# EasyEDA Pro project UltraSonic_Anemometer_HW.eprj

# Schematic Schematic1

## Sheets
1 TOP_LEVEL: Board Name: Board1; Create Date: 2025-11-26; Page Name: TOP_LEVEL; Project Name: UltraSonic_Anemometer_HW; Schematic Name: Schematic1; Update Date: 2025-11-26; Company: Tom Armstrong; Page Size: A4; Version: V1.0
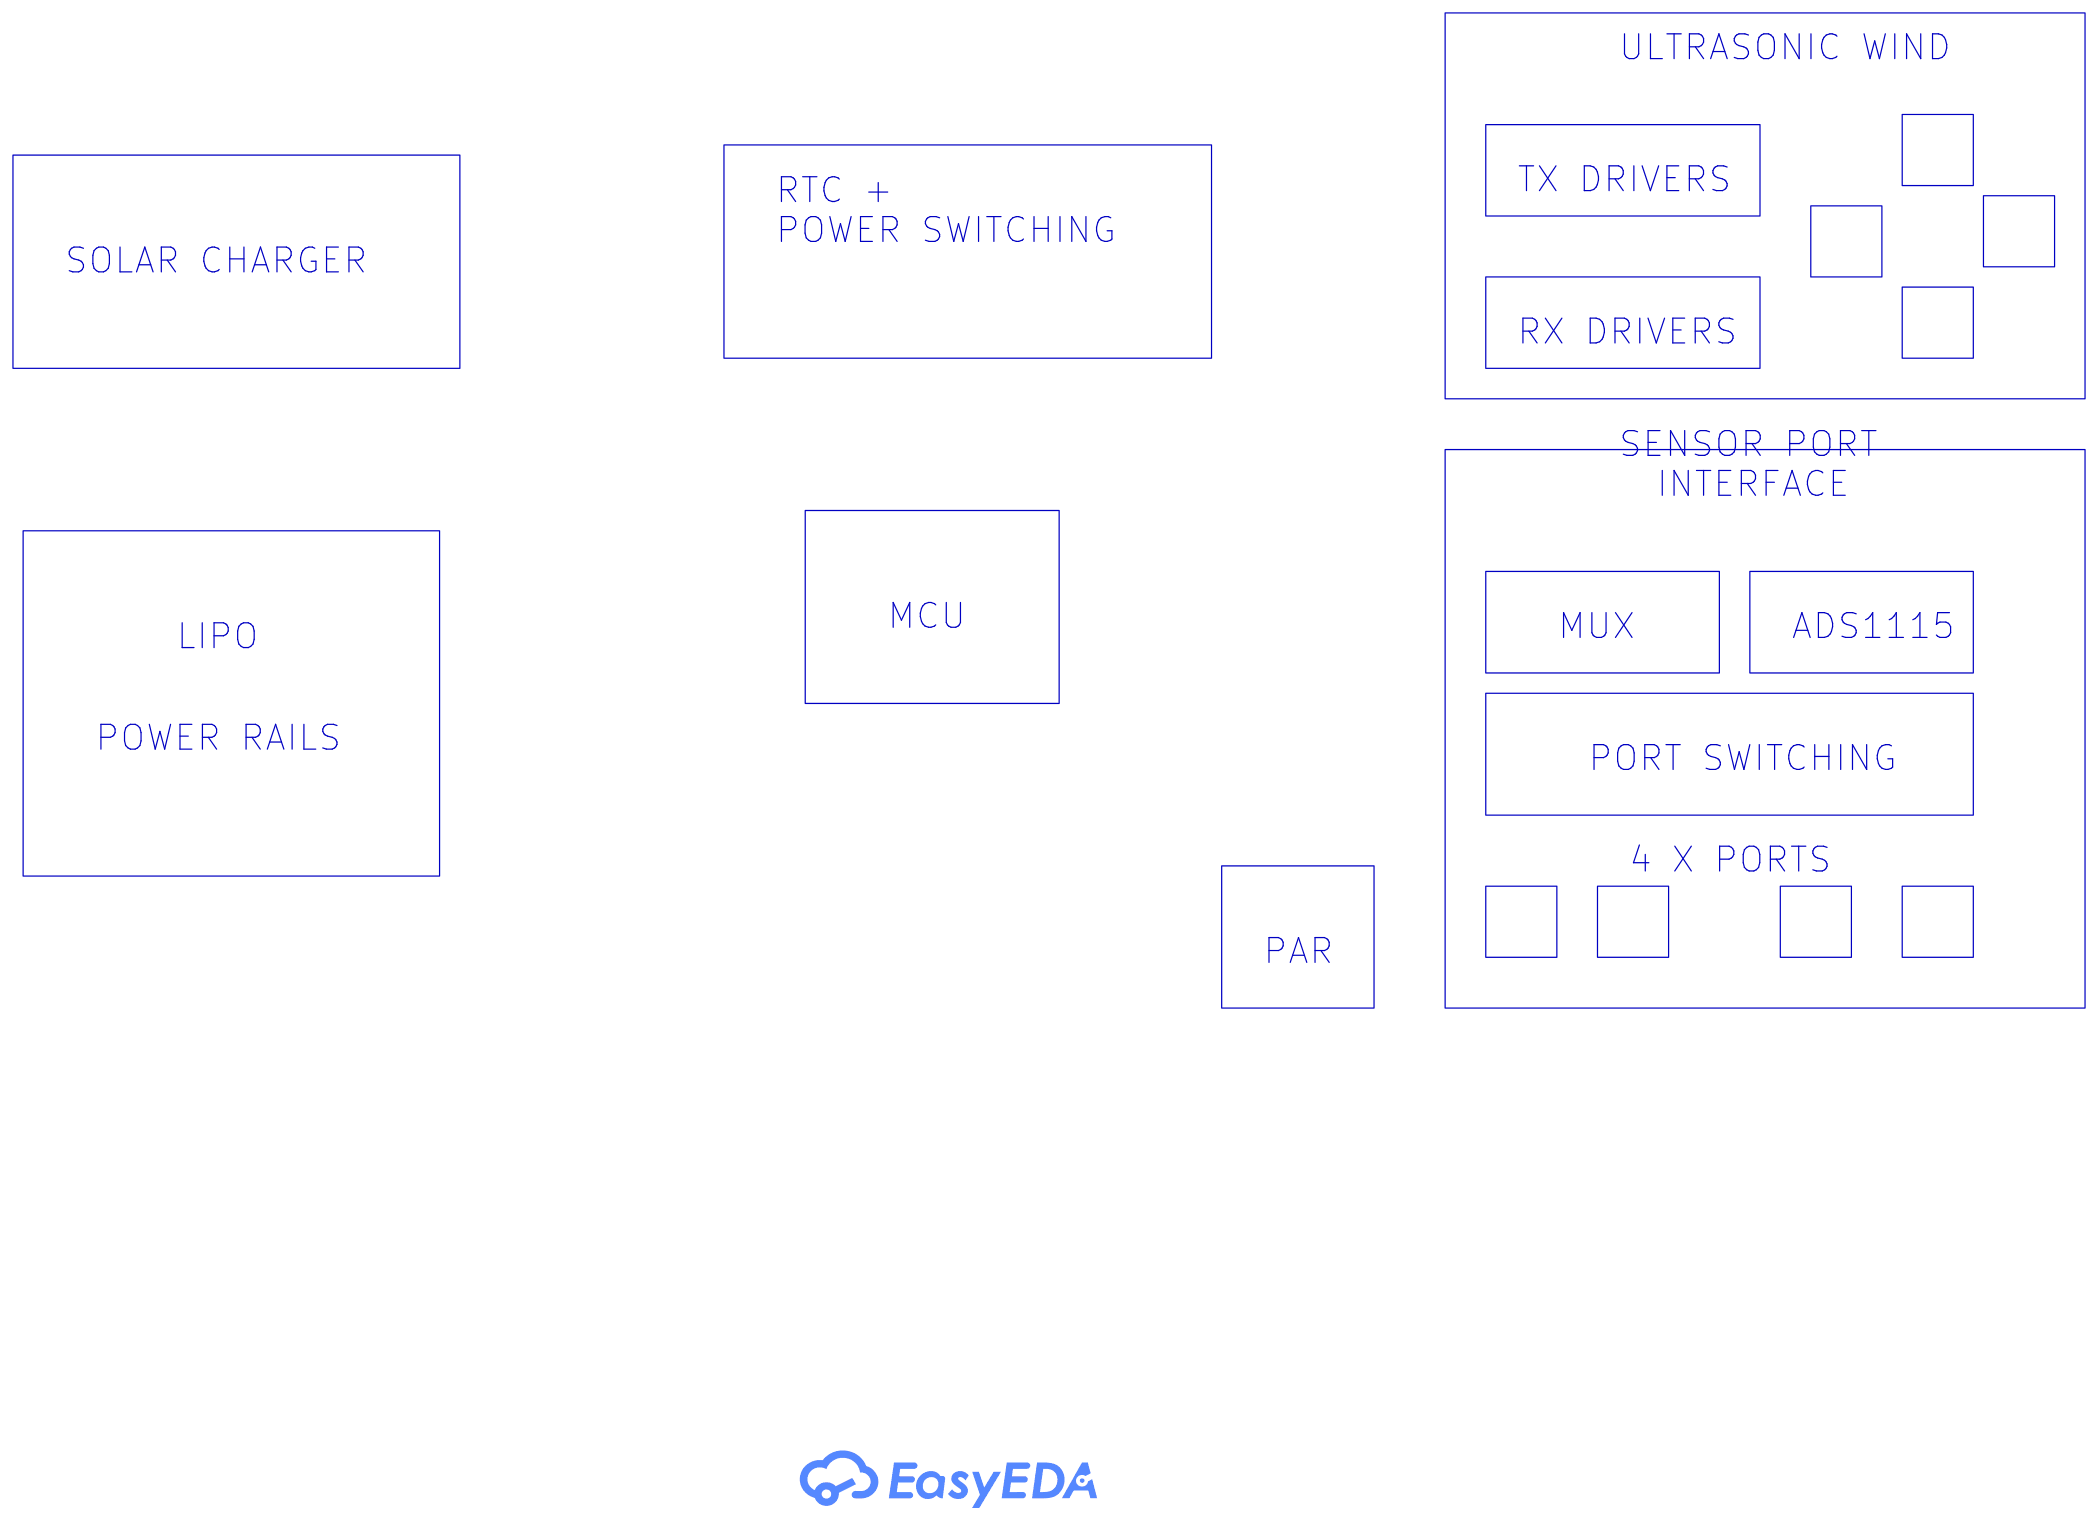
[diagram p0: TOP_LEVEL]
2 POWER: Create Date: 2025-11-27; Page Name: POWER; Update Date: 2025-12-18; Company: EasyEDA.com
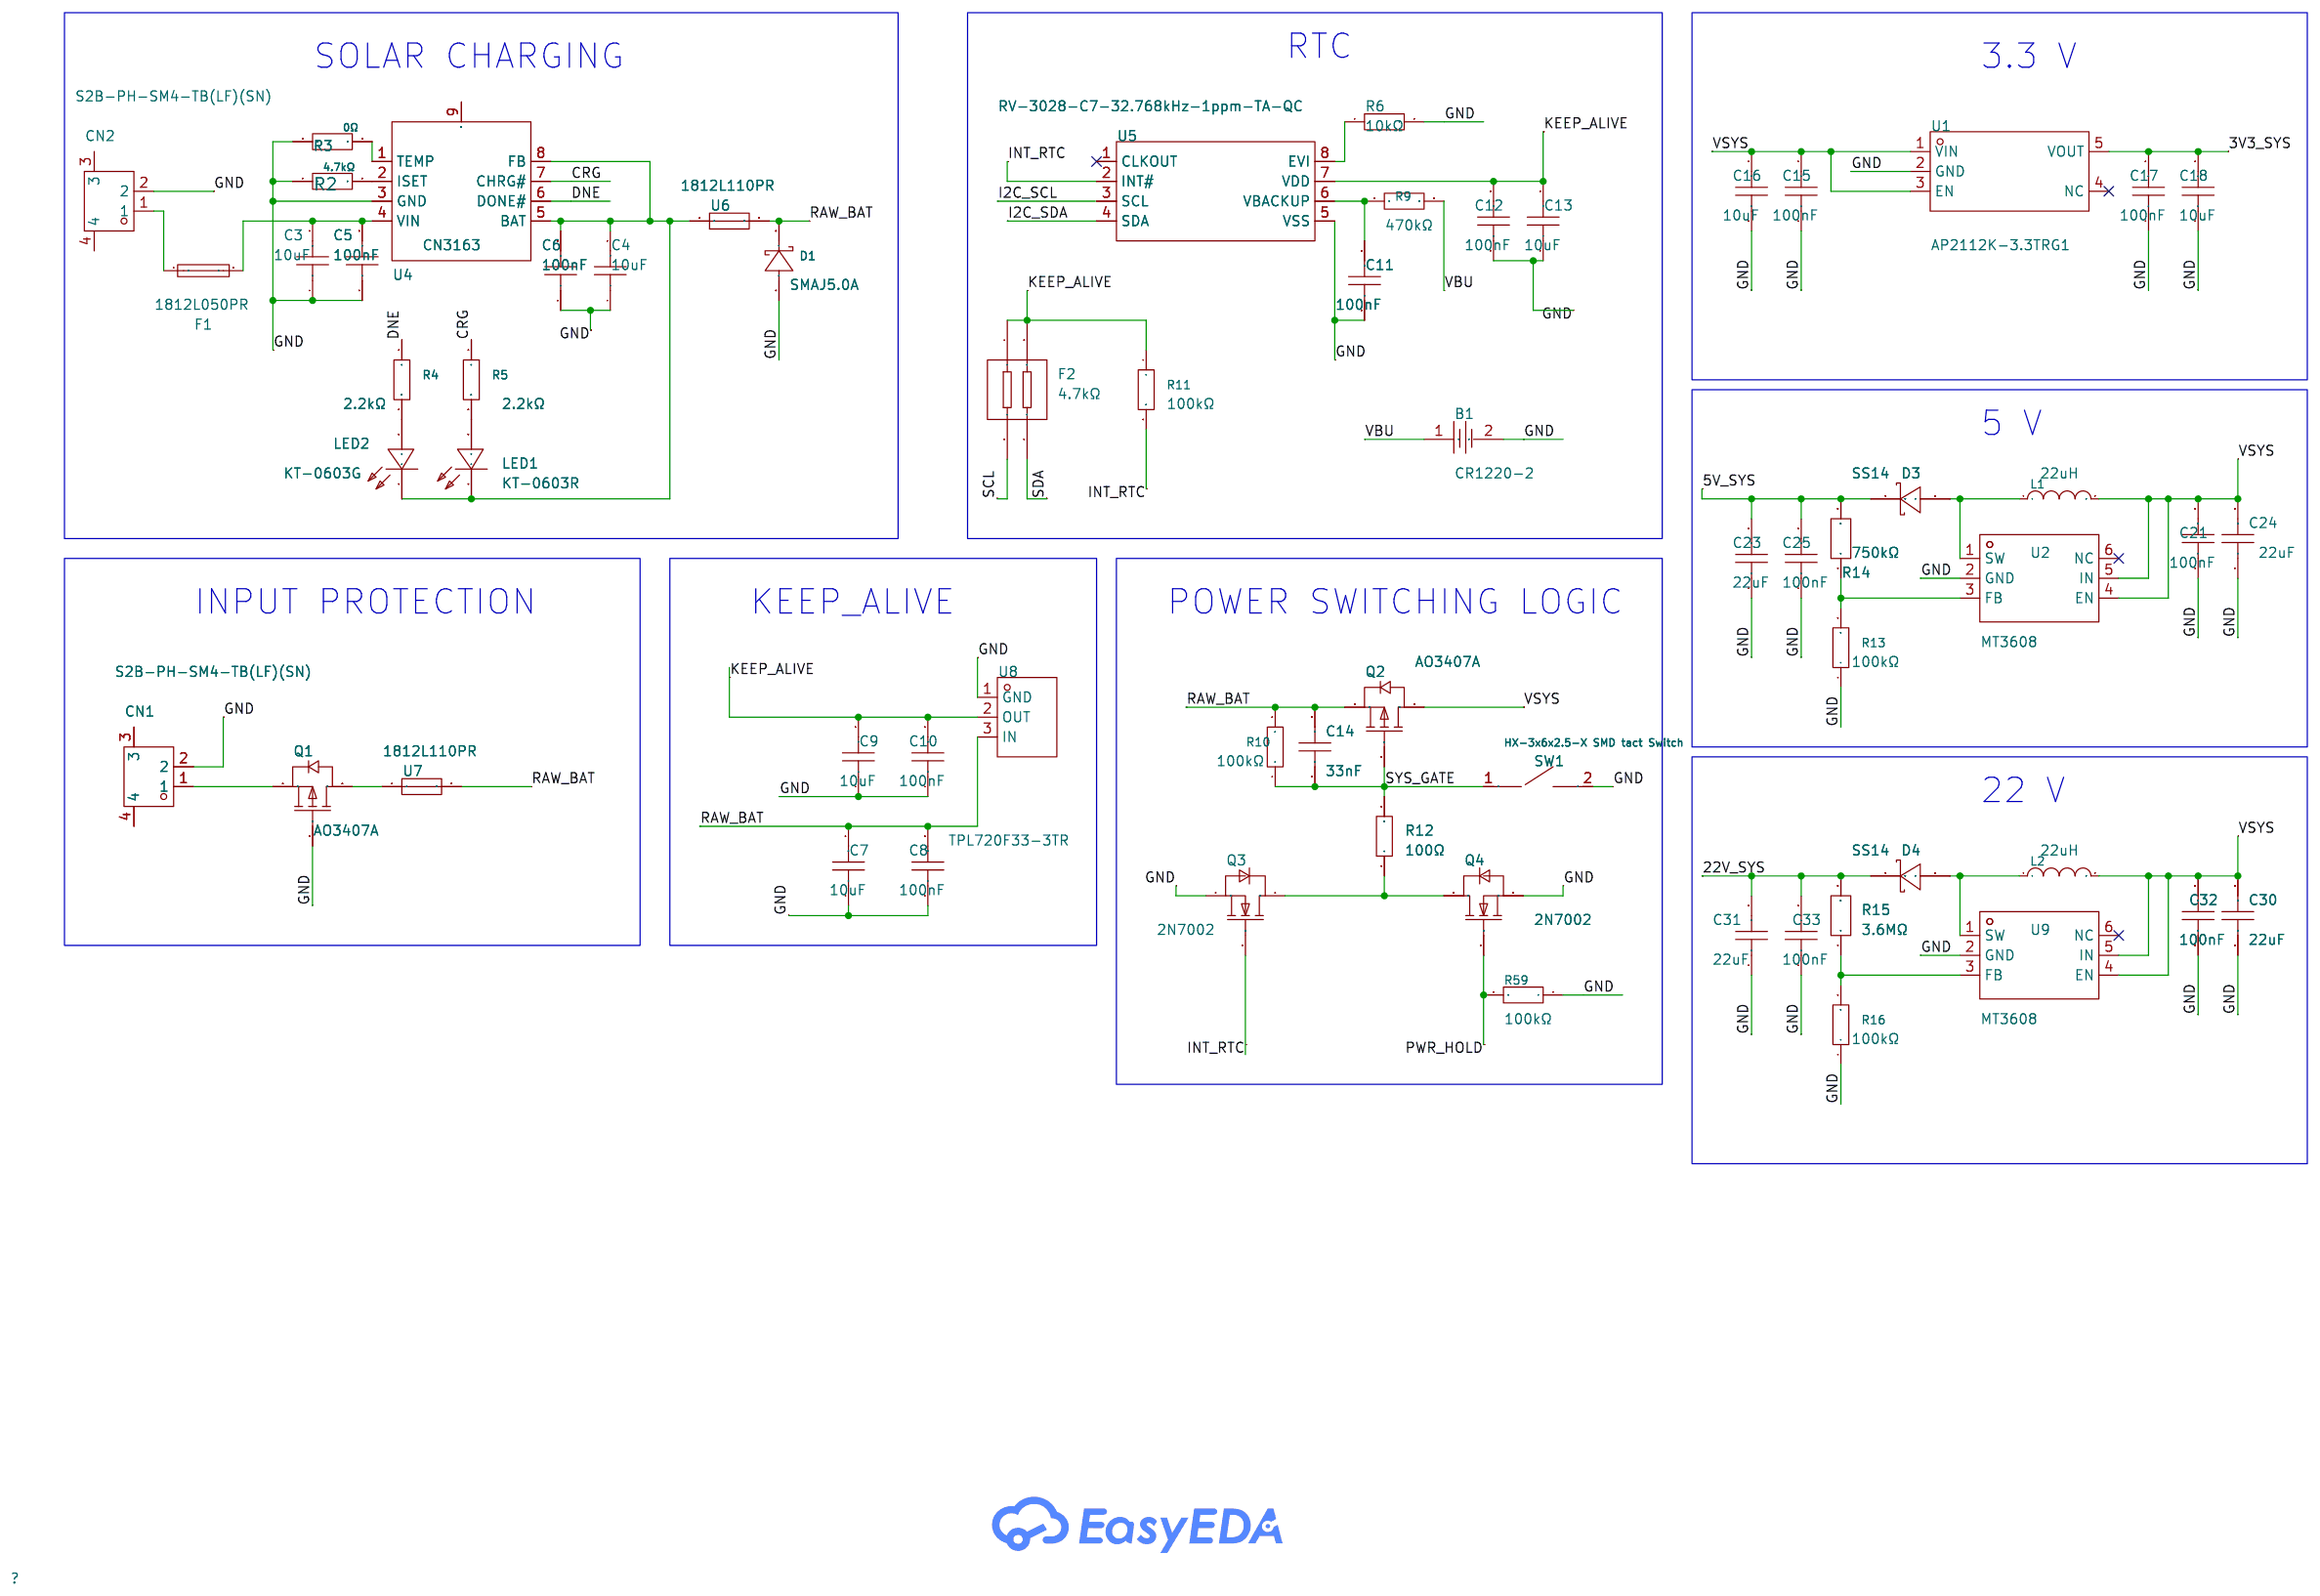
[diagram p1: POWER]
3 UlTRASONIC: Create Date: 2025-11-30; Page Name: UlTRASONIC; Update Date: 2025-11-30; Company: EasyEDA.com
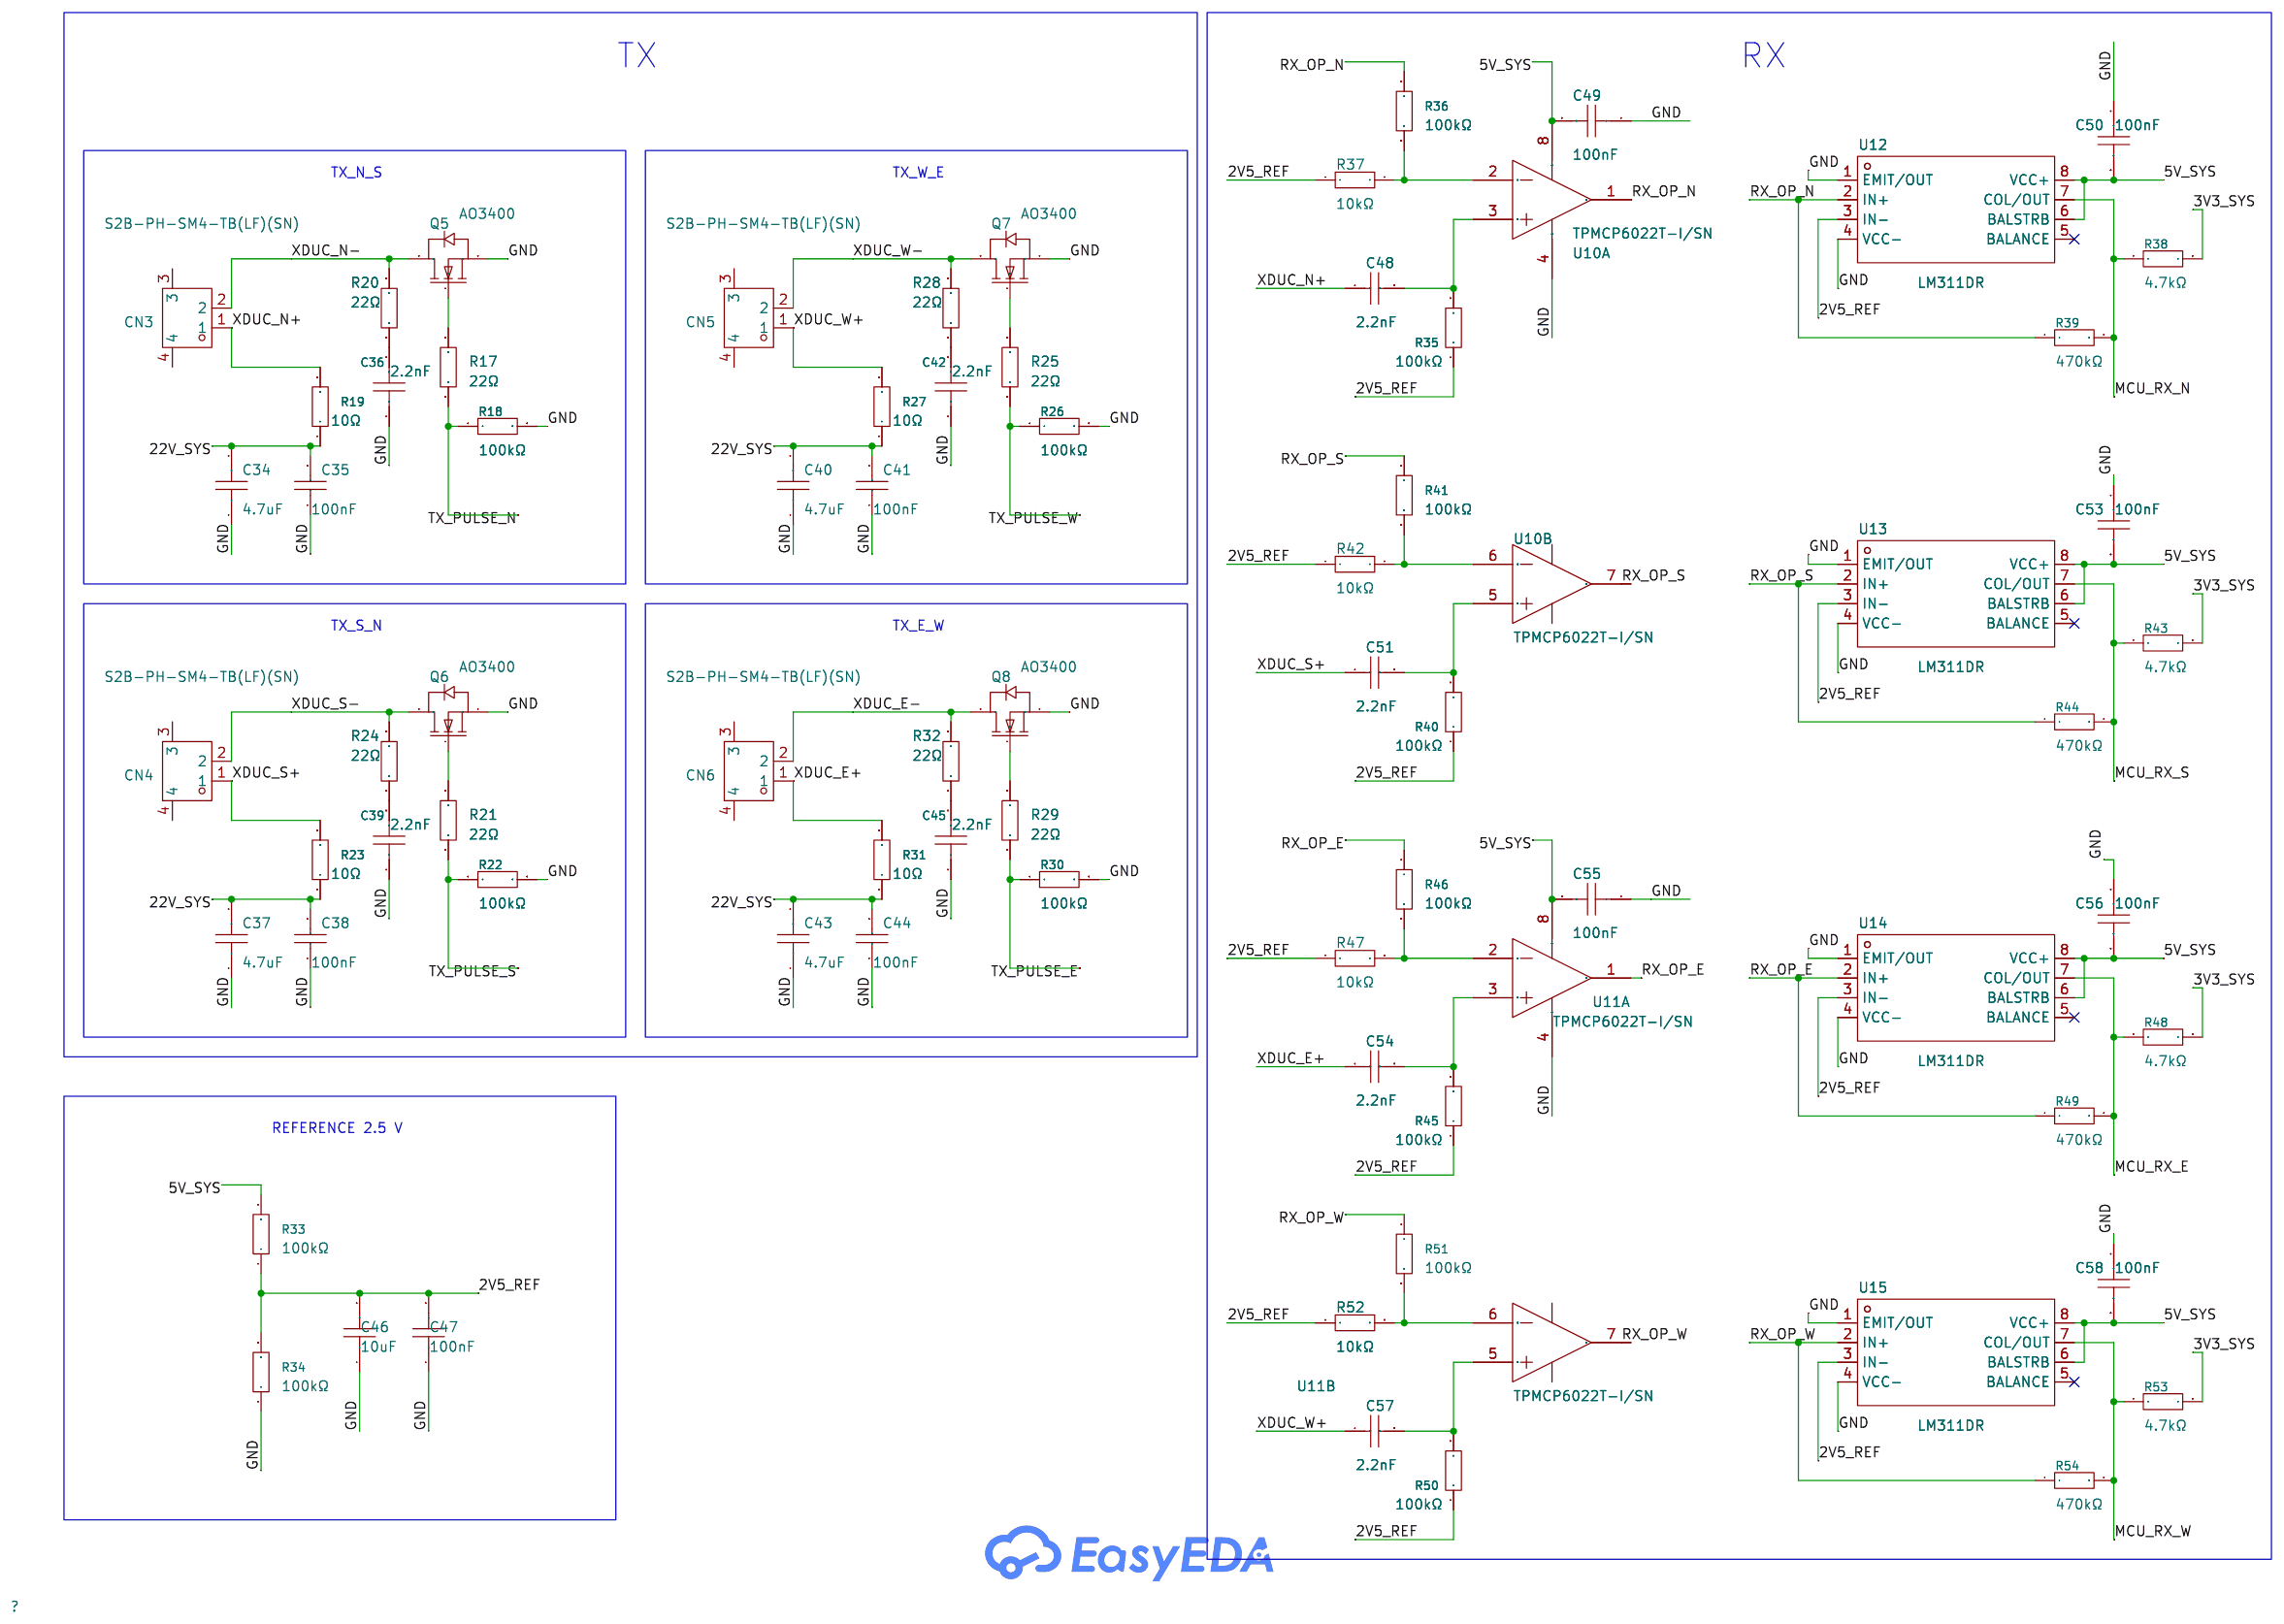
[diagram p2: UlTRASONIC]
4 MCU: Create Date: 2025-12-02; Page Name: MCU; Update Date: 2025-12-02; Company: EasyEDA.com
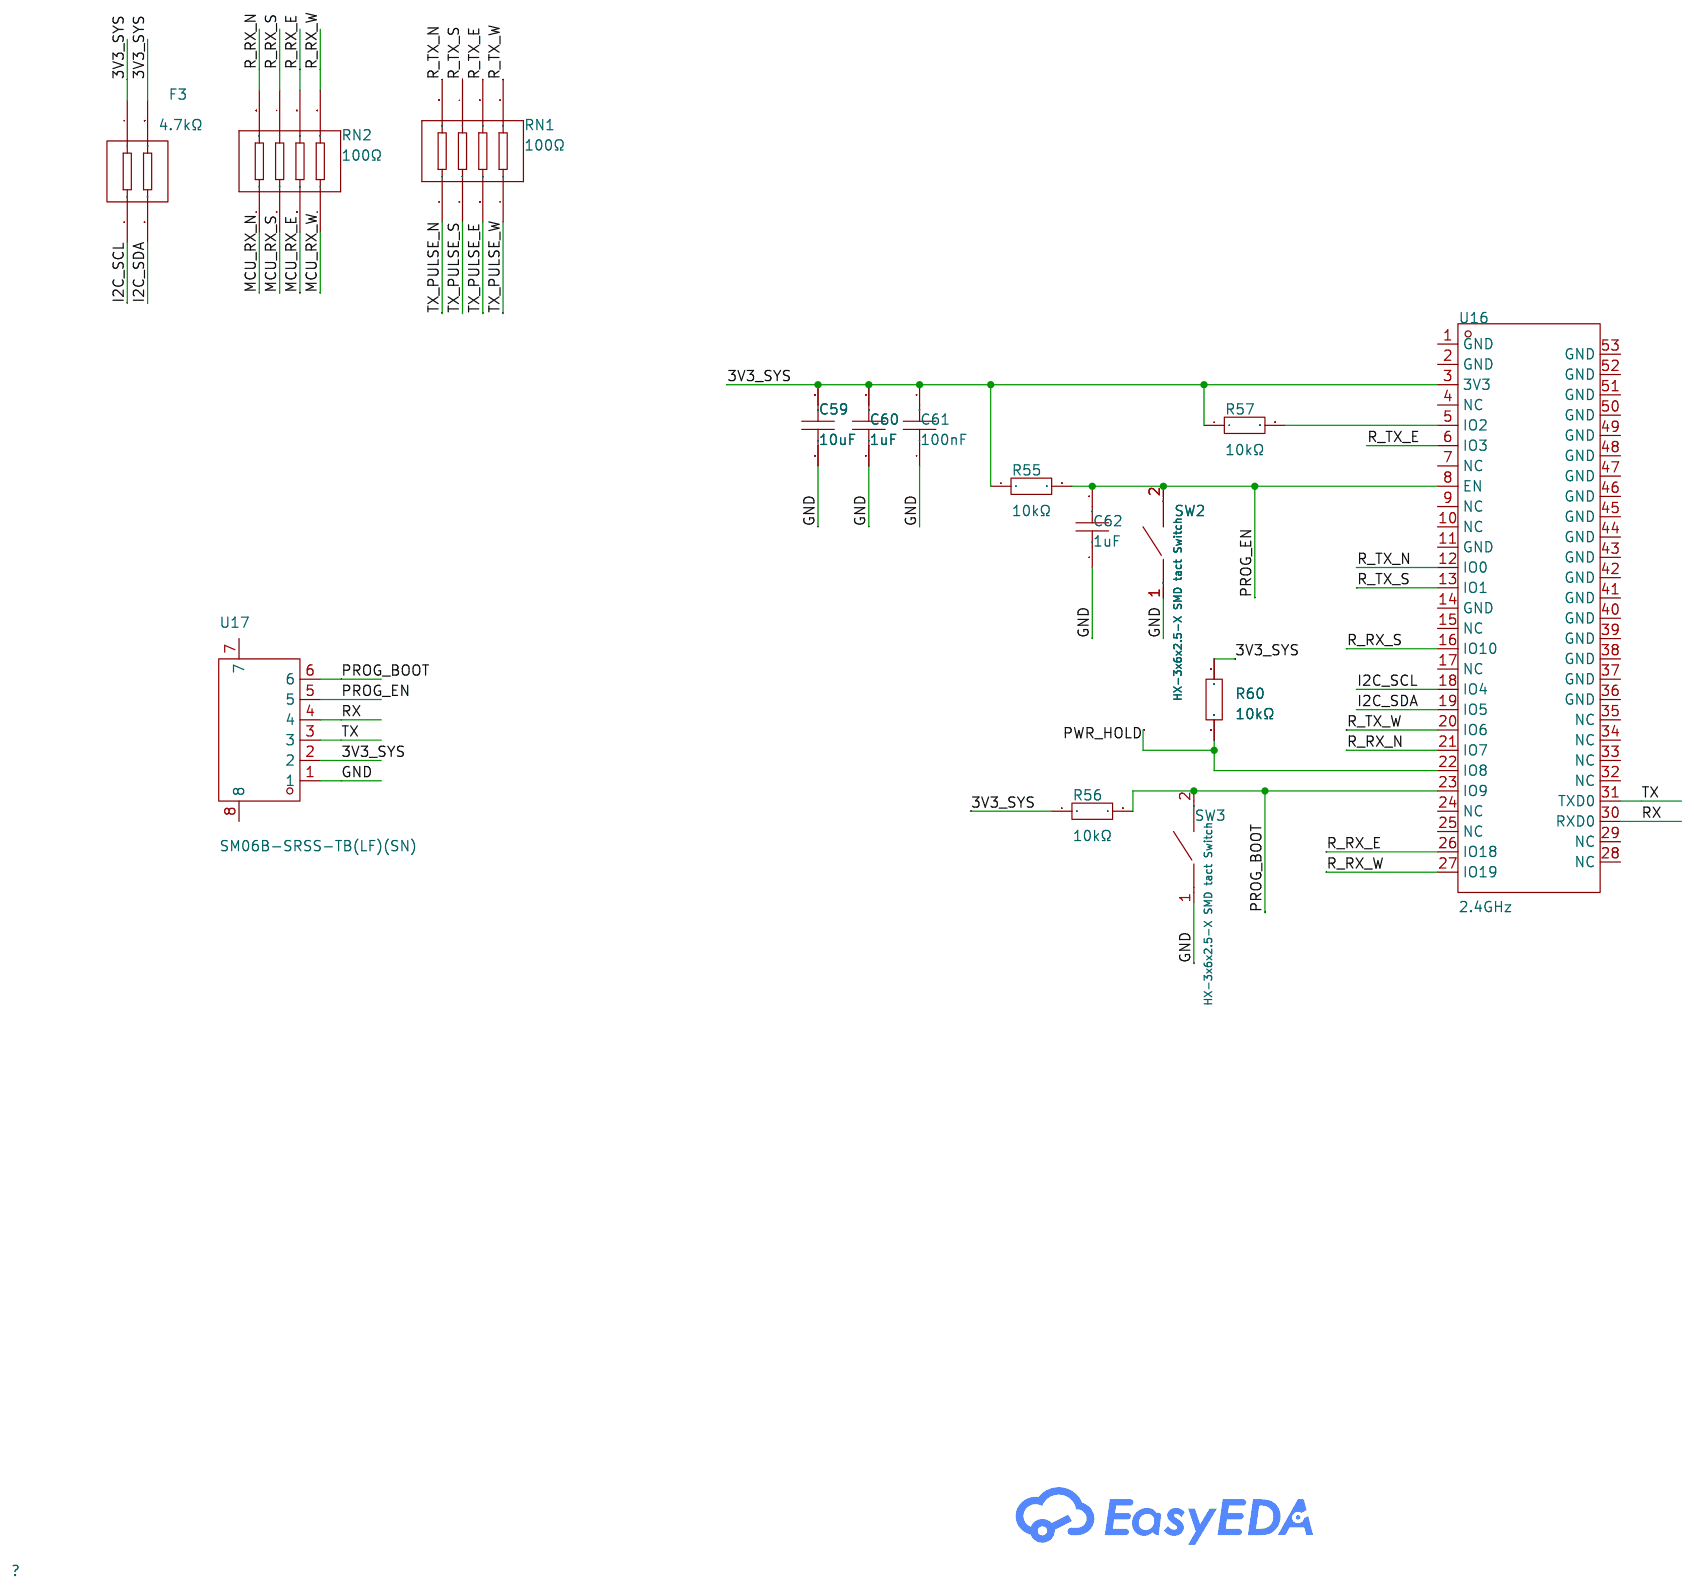
[diagram p3: MCU]
5 SENSOR PORTS: Create Date: 2025-12-04; Page Name: P1; Project Name: Project Name; Schematic Name: Schematic Name; Update Date: 2021.11.05; Company: EasyEDA.com
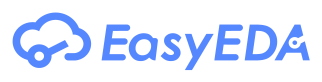
[diagram p4: SENSOR PORTS]

## Parts
sheet MCU
C59  10uF  [C0603]
C60  1uF  [C0603]
C61  100nF  [C0402]
C62  1uF  [C0603]
F3  4.7kΩ  [RES-ARRAY-SMD_0404-4P-L1.0-W1.0-BL]
R55  10kΩ  [R0402]
R56  10kΩ  [R0402]
R57  10kΩ  [R0402]
R60  10kΩ  [R0402]
RN1  100Ω  [RES-ARRAY-SMD_0804-8P-L2.0-W1.0-BL]
RN2  100Ω  [RES-ARRAY-SMD_0804-8P-L2.0-W1.0-BL]
SW2  HX-3x6x2.5-X SMD tact Switch  [SW-SMD_HX-3X6X2.5-X]
SW3  HX-3x6x2.5-X SMD tact Switch  [SW-SMD_HX-3X6X2.5-X]
U16  2.4GHz  [WIFIM-SMD_ESP32-C3-MINI-1]
U17  SM06B-SRSS-TB(LF)(SN)  [CONN-SMD_SM06B-SRSS-TB-LF-SN]
sheet POWER
B1  CR1220-2  [BAT-SMD_CR1220-2]
C3  10uF  [C0603]
C4  10uF  [C0603]
C5  100nF  [C0402]
C6  100nF  [C0402]
C7  10uF  [C0603]
C8  100nF  [C0402]
C9  10uF  [C0603]
C10  100nF  [C0402]
C11  100nF  [C0402]
C12  100nF  [C0402]
C13  10uF  [C0603]
C14  33nF  [C0402]
C15  100nF  [C0402]
C16  10uF  [C0603]
C17  100nF  [C0402]
C18  10uF  [C0603]
C21  100nF  [C0402]
C23  22uF  [C0603]
C24  22uF  [C0603]
C25  100nF  [C0402]
C30  22uF  [C1210]
C31  22uF  [C1210]
C32  100nF  [C0402]
C33  100nF  [C0402]
CN1  S2B-PH-SM4-TB(LF)(SN)  [CONN-SMD_P2.00_S2B-PH-SM4-TB-LF-SN]
CN2  S2B-PH-SM4-TB(LF)(SN)  [CONN-SMD_P2.00_S2B-PH-SM4-TB-LF-SN]
D1  SMAJ5.0A  [SMA_L4.4-W2.6-LS5.0-R-RD]
D3  SS14  [SMA_L4.4-W2.6-LS5.0-RD]
D4  SS14  [SMA_L4.4-W2.6-LS5.0-RD]
F1  1812L050PR  [F1812]
F2  4.7kΩ  [RES-ARRAY-SMD_0404-4P-L1.0-W1.0-BL]
L1  22uH  [IND-SMD_L4.6-W4.2_SMMS0420]
L2  22uH  [IND-SMD_L4.6-W4.2_SMMS0420]
LED1  KT-0603R  [LED0603-RD]
LED2  KT-0603G  [LED0603-RD]
Q1  AO3407A  [SOT-23-3_L2.9-W1.6-P1.90-LS2.8-BR]
Q2  AO3407A  [SOT-23-3_L2.9-W1.6-P1.90-LS2.8-BR]
Q3  2N7002  [SOT-23-3_L2.9-W1.3-P1.90-LS2.4-BR]
Q4  2N7002  [SOT-23-3_L2.9-W1.3-P1.90-LS2.4-BR]
R2  4.7kΩ  [R0402]
R3  0Ω  [R0603]
R4  2.2kΩ  [R0402]
R5  2.2kΩ  [R0402]
R6  10kΩ  [R0402]
R9  470kΩ  [R0603]
R10  100kΩ  [R0402]
R11  100kΩ  [R0402]
R12  100Ω  [R0402]
R13  100kΩ  [R0402]
R14  750kΩ  [R0402]
R15  3.6MΩ  [R0402]
R16  100kΩ  [R0402]
R59  100kΩ  [R0402]
SW1  HX-3x6x2.5-X SMD tact Switch  [SW-SMD_HX-3X6X2.5-X]
U1  AP2112K-3.3TRG1  [SOT-25-5_L2.9-W1.6-P0.95-LS2.8-BL]
U2  MT3608  [SOT-23-6_L2.9-W1.6-P0.95-LS2.8-BL]
U4  CN3163  [ESOP-8_L4.9-W3.9-P1.27-LS6.0-BL-EP]
U5  RV-3028-C7-32.768kHz-1ppm-TA-QC  [OSC-SMD_8P-L3.2-W1.5-P0.90-BL]
U6  1812L110PR  [FUSE-SMD_L4.7-W3.4]
U7  1812L110PR  [FUSE-SMD_L4.7-W3.4]
U8  TPL720F33-3TR  [SOT-23-3_L2.9-W1.6-P1.90-LS2.8-BR]
U9  MT3608  [SOT-23-6_L2.9-W1.6-P0.95-LS2.8-BL]
sheet UlTRASONIC
C34  4.7uF  [C0603]
C35  100nF  [C0402]
C36  2.2nF  [C0402]
C37  4.7uF  [C0603]
C38  100nF  [C0402]
C39  2.2nF  [C0402]
C40  4.7uF  [C0603]
C41  100nF  [C0402]
C42  2.2nF  [C0402]
C43  4.7uF  [C0603]
C44  100nF  [C0402]
C45  2.2nF  [C0402]
C46  10uF  [C0603]
C47  100nF  [C0402]
C48  2.2nF  [C0402]
C49  100nF  [C0402]
C50  100nF  [C0402]
C51  2.2nF  [C0402]
C53  100nF  [C0402]
C54  2.2nF  [C0402]
C55  100nF  [C0402]
C56  100nF  [C0402]
C57  2.2nF  [C0402]
C58  100nF  [C0402]
CN3  S2B-PH-SM4-TB(LF)(SN)  [CONN-SMD_P2.00_S2B-PH-SM4-TB-LF-SN]
CN4  S2B-PH-SM4-TB(LF)(SN)  [CONN-SMD_P2.00_S2B-PH-SM4-TB-LF-SN]
CN5  S2B-PH-SM4-TB(LF)(SN)  [CONN-SMD_P2.00_S2B-PH-SM4-TB-LF-SN]
CN6  S2B-PH-SM4-TB(LF)(SN)  [CONN-SMD_P2.00_S2B-PH-SM4-TB-LF-SN]
Q5  AO3400  [SOT-23-3_L2.9-W1.3-P1.90-LS2.4-BR]
Q6  AO3400  [SOT-23-3_L2.9-W1.3-P1.90-LS2.4-BR]
Q7  AO3400  [SOT-23-3_L2.9-W1.3-P1.90-LS2.4-BR]
Q8  AO3400  [SOT-23-3_L2.9-W1.3-P1.90-LS2.4-BR]
R17  22Ω  [R0402]
R18  100kΩ  [R0402]
R19  10Ω  [R0402]
R20  22Ω  [R0402]
R21  22Ω  [R0402]
R22  100kΩ  [R0402]
R23  10Ω  [R0402]
R24  22Ω  [R0402]
R25  22Ω  [R0402]
R26  100kΩ  [R0402]
R27  10Ω  [R0402]
R28  22Ω  [R0402]
R29  22Ω  [R0402]
R30  100kΩ  [R0402]
R31  10Ω  [R0402]
R32  22Ω  [R0402]
R33  100kΩ  [R0402]
R34  100kΩ  [R0402]
R35  100kΩ  [R0402]
R36  100kΩ  [R0402]
R37  10kΩ  [R0402]
R38  4.7kΩ  [R0402]
R39  470kΩ  [R0603]
R40  100kΩ  [R0402]
R41  100kΩ  [R0402]
R42  10kΩ  [R0402]
R43  4.7kΩ  [R0402]
R44  470kΩ  [R0603]
R45  100kΩ  [R0402]
R46  100kΩ  [R0402]
R47  10kΩ  [R0402]
R48  4.7kΩ  [R0402]
R49  470kΩ  [R0603]
R50  100kΩ  [R0402]
R51  100kΩ  [R0402]
R52  10kΩ  [R0402]
R53  4.7kΩ  [R0402]
R54  470kΩ  [R0603]
U10  TPMCP6022T-I/SN  [SOP-8_L4.9-W3.9-P1.27-LS6.0-BL]  (sections 1,2)
U11  TPMCP6022T-I/SN  [SOP-8_L4.9-W3.9-P1.27-LS6.0-BL]  (sections 1,2)
U12  LM311DR  [SOIC-8_L5.0-W4.0-P1.27-LS6.0-BL]
U13  LM311DR  [SOIC-8_L5.0-W4.0-P1.27-LS6.0-BL]
U14  LM311DR  [SOIC-8_L5.0-W4.0-P1.27-LS6.0-BL]
U15  LM311DR  [SOIC-8_L5.0-W4.0-P1.27-LS6.0-BL]

## Library data of the parts
C46 C59 = CL10A106KP8NNNC: LCSC Part Name: 10uF ±10% 10V; Supplier Part: C19702; Manufacturer: SAMSUNG(三星); Supplier Footprint: 0603; JLCPCB Part Class: Basic Part; Datasheet: https://item.szlcsc.com/datasheet/CL10A106KP8NNNC/20411.html; Supplier: LCSC; Tolerance: ±10%; Voltage Rating: 10V; Temperature Coefficient: X5R
C60 C62 = CGA0603X5R105K500JT: LCSC Part Name: 1uF ±10% 50V; Supplier Part: C6119852; Manufacturer: HRE(芯声); Supplier Footprint: 0603; JLCPCB Part Class: Extended Part; Supplier: LCSC; Tolerance: ±10%; Voltage Rating: 50V; Temperature Coefficient: X5R
C47 C49 C50 C53 C55 C56 C58 C61 = CL05B104KO5NNNC: LCSC Part Name: 100nF ±10% 16V; Supplier Part: C1525; Manufacturer: SAMSUNG(三星); Supplier Footprint: 0402; JLCPCB Part Class: Basic Part; Datasheet: https://item.szlcsc.com/datasheet/CL05B104KO5NNNC/1877.html; Supplier: LCSC; Tolerance: ±10%; Voltage Rating: 16V; Temperature Coefficient: X7R
F2 F3 = YC122-JR-074K7L: LCSC Part Name: 4.7kΩ ±5%; Supplier Part: C695194; Manufacturer: YAGEO(国巨); Supplier Footprint: 0402x2; JLCPCB Part Class: Extended Part; Datasheet: https://atta.szlcsc.com/upload/public/pdf/source/20200630/C695194_9AE356AC45205632CCDCDD385AB75EB3.pdf; Supplier: LCSC; Tolerance: ±5%; Temperature Coefficient: ±200ppm/℃
R6 R37 R42 R47 R52 R55-R57 R60 = 0402WGF1002TCE: LCSC Part Name: 10kΩ ±1% 62.5mW 厚膜电阻; Supplier Part: C25744; Manufacturer: UNI-ROYAL(厚声); Supplier Footprint: 0402; JLCPCB Part Class: Basic Part; Datasheet: https://item.szlcsc.com/datasheet/0402WGF1002TCE/26487.html; Supplier: LCSC; Type: Thick Film Resistor; Tolerance: ±1%; Power(Watts): 62.5mW; Voltage-Supply(Max): 50V; Temperature Coefficient: ±100ppm/℃; Operating Temperature: -55℃~+155℃
RN1 RN2 = YC124-JR-07100RL: LCSC Part Name: 100Ω ±5%; Supplier Part: C326873; Manufacturer: YAGEO(国巨); Supplier Footprint: 0402x4; JLCPCB Part Class: Extended Part; Datasheet: https://item.szlcsc.com/datasheet/YC124-JR-07100RL/306967.html; Supplier: LCSC; Tolerance: ±5%; Power(Watts): 62.5mW; Temperature Coefficient: ±200ppm/℃
SW1-SW3 = HX-3x6x2.5-X SMD tact Switch: LCSC Part Name: 6*3.5*2.5mm 立贴 轻触开关; Supplier Part: C49234125; Manufacturer: hanxia(韩下); Supplier Footprint: SMD,6x3.5mm; JLCPCB Part Class: Extended Part; Datasheet: https://item.szlcsc.com/datasheet/HX-3x6x2.5-X%2520SMD%2520tact%2520Switch/51650186.html; Supplier: LCSC; Circuit: SPST; Actuator Style: Square Button; Operating Force: 2.5N; Mounting Type: Surface Mount,Vertical; Length: 6mm; Width: 3.6mm; Switch Height: 2.5mm; with Bracket: Without Bracket; Contact Current: 50mA; Voltage Rating: 250V; Actuator/Cap Color: White; With Lamp: No; Termination Style: SMD(SMT) Tab; Life: 30,000 Cycles; Operating Temperature: -25℃~+70℃
U16 = ESP32-C3-MINI-1-H4_C2934569: LCSC Part Name: ESP32-C3-MINI-1-H4; Supplier Part: C2934569; Manufacturer: ESPRESSIF(乐鑫); Manufacturer Part: ESP32-C3-MINI-1-H4; Supplier Footprint: SMD,13.2x16.6mm; JLCPCB Part Class: Extended Part; Datasheet: https://atta.szlcsc.com/upload/public/pdf/source/20211222/4A6E563D9536B67D492463D36DD57C1D.pdf; Supplier: LCSC; Support Interface: SPI; Antenna Type: On-Board PCB Antenna; Output Power: 20.5dBm; Operating Voltage: 3.3V; Sensitivity: -96dBm; Operating Temperature: -40℃~+85℃
U17 = SM06B-SRSS-TB(LF)(SN): LCSC Part Name: 1x6P 间距:1mm 卧贴 系列:SH; Supplier Part: C160405; Manufacturer: JST; Supplier Footprint: SMD,P=1mm,卧贴; JLCPCB Part Class: Extended Part; Datasheet: https://item.szlcsc.com/datasheet/SM06B-SRSS-TB(LF)(SN)/171785.html; Supplier: LCSC; Pins Structure: 1x6P; Pitch: 1mm; Mounting Type: Surface Mount, Right Angle; Reference Series: SH; Number of Pins: 6P; Number of Rows: 1; Number of PINs Per Row: 6; Current Rating: 1A; Contact Material: Copper Alloy; Contact Plating: Tin; Operating Temperature: -25℃~+85℃; Voltage Rating: 50V; Plastic Material: PA; Flame Retardant Rating: UL94V-0; Supplementary Features: Auxiliary Solder Pin; Color: White; Z-Height of the Board: 2.9mm; X-Length of Bottom Edge on Board (Spacing Line): 8mm; Y-Width of Bottom Edge on Board: 4.32mm
B1 = CR1220-2: LCSC Part Name: 电池底座 适用电池:CR1220; Supplier Part: C70381; Manufacturer: QIJEY; Supplier Footprint: SMD; JLCPCB Part Class: Extended Part; Datasheet: https://item.szlcsc.com/datasheet/CR1220-2/71476.html; Supplier: LCSC; Connector Type: Battery Holder; Battery Type: CR1220
C3 C4 C7 C9 C13 C16 C18 = GRM188Z71A106KA73D: Capacitance: Tolerance:±10% Tolerance:±10% Voltage Rated: Temperature Coefficient:; LCSC Part Name: 10uF ±10% 10V; Supplier Part: C2959727; Manufacturer: muRata(村田); Supplier Footprint: 0603; JLCPCB Part Class: Extended Part; Datasheet: https://atta.szlcsc.com/upload/public/pdf/source/20220328/6A4892B7E841253269A84FFE395E0578.pdf; Supplier: LCSC; Tolerance: ±10%
C5 C6 C8 C10-C12 C15 C17 C21 C25 = CL05B104KO5NNNC: Capacitance:100nF Tolerance:±10% Tolerance:±10% Voltage Rating:16V Temperature Coefficient:X7R; LCSC Part Name: 100nF ±10% 16V; Supplier Part: C1525; Manufacturer: SAMSUNG(三星); Supplier Footprint: 0402; JLCPCB Part Class: Basic Part; Datasheet: https://item.szlcsc.com/datasheet/CL05B104KO5NNNC/1877.html; Supplier: LCSC; Tolerance: ±10%; Voltage Rating: 16V; Temperature Coefficient: X7R
C14 = 0402B333K160CT: LCSC Part Name: 33nF ±10% 16V; Supplier Part: C301939; Manufacturer: Walsin(华新科); Supplier Footprint: 0402; JLCPCB Part Class: Extended Part; Datasheet: https://item.szlcsc.com/datasheet/0402B333K160CT/287760.html; Supplier: LCSC; Tolerance: ±10%; Voltage Rating: 16V; Temperature Coefficient: X7R
C23 C24 = CL10A226MP8NUNE: LCSC Part Name: 22uF ±20% 10V; Supplier Part: C86295; Manufacturer: SAMSUNG(三星); Supplier Footprint: 0603; JLCPCB Part Class: Extended Part; Datasheet: https://item.szlcsc.com/datasheet/CL10A226MP8NUNE/87471.html; Supplier: LCSC; Tolerance: ±20%; Voltage Rating: 10V; Temperature Coefficient: X5R
C30 C31 = CL32B226KAJNNNE: LCSC Part Name: 22uF ±10% 25V; Supplier Part: C309062; Manufacturer: SAMSUNG(三星); Supplier Footprint: 1210; JLCPCB Part Class: Extended Part; Datasheet: https://item.szlcsc.com/datasheet/CL32B226KAJNNNE/292813.html; Supplier: LCSC; Tolerance: ±10%; Voltage Rating: 25V; Temperature Coefficient: X7R
C32 C33 = CGA0402X7R104K250GT: LCSC Part Name: 100nF ±10% 25V; Supplier Part: C6119778; Manufacturer: HRE(芯声); Supplier Footprint: 0402; JLCPCB Part Class: Extended Part; Supplier: LCSC; Tolerance: ±10%; Voltage Rating: 25V; Temperature Coefficient: X7R
CN1-CN6 = S2B-PH-SM4-TB(LF)(SN): Pins Structure:1x2P Pitch:2mm Mounting Style:Horizontal attachment Reference Series:PH Number of Pins:2P Number of Rows:1 Number of PINs Per Row:2 Row Spacing:- Current Rating (Max):2A Contact Material:Copper alloy Contact Plating:Tin Operating Temperatur; LCSC Part Name: 1x2P 间距:2mm 卧贴 系列:PH; Supplier Part: C295747; Manufacturer: JST; Supplier Footprint: SMD,P=2mm,卧贴; JLCPCB Part Class: Extended Part; Datasheet: https://atta.szlcsc.com/upload/public/pdf/source/20210203/C295747_344B2E64535E381E727D98C302AB61C7.pdf; Supplier: LCSC; Pins Structure: 1x2P; Pitch: 2mm; Mounting Style: Horizontal attachment; Reference Series: PH; Number of Pins: 2P; Number of Rows: 1; Number of PINs Per Row: 2; Current Rating (Max): 2A; Contact Material: Copper alloy; Contact Plating: Tin; Operating Temperature Range: -25℃~+85℃; Rated Voltage (Max): 100V; Plastic Material: PA; Flame Retardant Rating: UL94V-0; Supplementary Features: Auxiliary soldering legs; Colour: Beige; Z-Height of the Board: 5.5mm; X-Length of Bottom Edge on Board (Spacing Line): 7.9mm; Y-Width of Bottom Edge on Board: 8.6mm
D1 = SMAJ5.0A_C499811: LCSC Part Name: 单向TVS; Supplier Part: C499811; Manufacturer: SHIKUES(时科); Supplier Footprint: SMA; JLCPCB Part Class: Extended Part; Datasheet: https://atta.szlcsc.com/upload/public/pdf/source/20200917/C499811_DE74FDA4883B7C6B3588B518ADF1C10D.pdf; Supplier: LCSC
D3 D4 = SS14_C48782961: LCSC Part Name: 40V 1A; Supplier Part: C48782961; Manufacturer: HT(金誉); Supplier Footprint: SMA; JLCPCB Part Class: Extended Part; Datasheet: https://item.szlcsc.com/datasheet/SS14/51079493.html; Supplier: LCSC; Voltage - Forward(Vf@If): 700mV@1A; Voltage - DC Reverse(Vr): 40V; Current - Rectified: 1A; Operating Junction Temperature Range: -55℃~+150℃; Non-Repetitive Peak Forward Surge Current: 30A
F1 = 1812L050PR: LCSC Part Name: 15V 500mA 1812自恢复; Supplier Part: C151169; Manufacturer: Littelfuse(美国力特); Supplier Footprint: 1812; JLCPCB Part Class: Extended Part; Datasheet: https://atta.szlcsc.com/upload/public/pdf/source/20181031/C315901_C3D1AA68B7E2FCFB6B7163300867CF3D.pdf; Supplier: LCSC; Operating Voltage (Max): 15V; Current Rating (Max): 100A; Hold Current: 500mA; Trip Current: 1A; Resistance - Initial (Ri) (Min): 150mΩ; Resistance - Post Trip (R1) (Max): 1Ω; Maximum Time to Trip: 150ms; Operating Temperature: -40℃~+85℃
L1 L2 = SMMS0420-220M: LCSC Part Name: 22uH ±20% 1.5A; Supplier Part: C2894720; Manufacturer: SXN(顺翔诺); Supplier Footprint: SMD,4.6x4.2x2mm; JLCPCB Part Class: Extended Part; Datasheet: https://item.szlcsc.com/datasheet/SMMS0420-220M/3130467.html; Supplier: LCSC; Tolerance: ±20%; Current Rating: 1.2A; Current - Saturation(Isat): 1.5A; DC Resistance(DCR): 510mΩ
LED1 = KT-0603R: LCSC Part Name: 0603 红灯 高亮; Supplier Part: C2286; Manufacturer: KENTO; Supplier Footprint: 0603; JLCPCB Part Class: Basic Part; Datasheet: https://atta.szlcsc.com/upload/public/pdf/source/20160616/1466072038404.pdf; Supplier: LCSC; Emitted Color: Red; Operating Temperature: -40℃~+85℃
LED2 = KT-0603G: LCSC Part Name: 0603 翠绿 高亮; Supplier Part: C12624; Manufacturer: KENTO; Supplier Footprint: 0603; JLCPCB Part Class: Extended Part; Datasheet: https://item.szlcsc.com/datasheet/KT-0603G/13258.html; Supplier: LCSC; Illumination Color: Emerald Green; Voltage - Forward(Vf): 3.1V; Power(Watts): 100mW; Forward Current: 5mA; Wavelength - Dominant: 513nm~528nm; Peak Wavelength: 525nm; Lens Color: Water Clear; Luminous Intensity: 430mcd; Viewing Angle: 120°; Operating Temperature: -40℃~+85℃
Q1 Q2 = AO3407A_C15155: Number:1 P-Channel Drain to Source Voltage:30V Current - Continuous Drain(Id):4.3A RDS(on):48mΩ@10V Pd - Power Dissipation:- Gate Threshold Voltage (Vgs(th)):2.5V@250uA Gate Charge(Qg):16nC@10V Input Capacitance(Ciss):830pF Reverse Transfer Capacitance (C; LCSC Part Name: 1个P沟道 耐压:30V 电流:4.3A; Supplier Part: C15155; Manufacturer: AOS; Supplier Footprint: SOT-23; JLCPCB Part Class: Extended Part; Datasheet: https://item.szlcsc.com/datasheet/AO3407A/15829.html; Supplier: LCSC; Number: 1 P-Channel; Drain to Source Voltage: 30V; Current - Continuous Drain(Id): 4.3A; RDS(on): 48mΩ@10V; Gate Threshold Voltage (Vgs(th)): 2.5V@250uA; Gate Charge(Qg): 16nC@10V; Input Capacitance(Ciss): 830pF; Reverse Transfer Capacitance (Crss@Vds): 92pF@15V
Q3 Q4 = 2N7002_C51315010: Supplier Part: C51315010; Manufacturer: CBI(创基); Supplier Footprint: SOT-23; JLCPCB Part Class: Extended Part; Datasheet: https://item.szlcsc.com/datasheet/2N7002/53967148.html; Supplier: LCSC
R2 R38 R43 R48 R53 = 0402WGF4701TCE: LCSC Part Name: 4.7kΩ ±1% 62.5mW 厚膜电阻; Supplier Part: C25900; Manufacturer: UNI-ROYAL(厚声); Supplier Footprint: 0402; JLCPCB Part Class: Basic Part; Datasheet: https://item.szlcsc.com/datasheet/0402WGF4701TCE/26643.html; Supplier: LCSC; Type: Thick Film Resistor; Tolerance: ±1%; Power(Watts): 62.5mW; Voltage-Supply(Max): 50V; Temperature Coefficient: ±100ppm/℃; Operating Temperature: -55℃~+155℃
R3 = 0603WAF0000T5E: LCSC Part Name: 0Ω ±1% 100mW 厚膜电阻; Supplier Part: C21189; Manufacturer: UNI-ROYAL(厚声); Supplier Footprint: 0603; JLCPCB Part Class: Basic Part; Datasheet: https://item.szlcsc.com/datasheet/0603WAF0000T5E/21903.html; Supplier: LCSC; Type: Thick Film Resistor; Tolerance: ±1%; Power(Watts): 100mW; Voltage-Supply(Max): 75V; Operating Temperature: -55℃~+155℃
R4 R5 = 0402WGF2201TCE: LCSC Part Name: 2.2kΩ ±1% 62.5mW 厚膜电阻; Supplier Part: C25879; Manufacturer: UNI-ROYAL(厚声); Supplier Footprint: 0402; JLCPCB Part Class: Basic Part; Datasheet: https://item.szlcsc.com/datasheet/0402WGF2201TCE/26622.html; Supplier: LCSC; Type: Thick Film Resistor; Tolerance: ±1%; Power(Watts): 62.5mW; Voltage-Supply(Max): 50V; Temperature Coefficient: ±100ppm/℃; Operating Temperature: -55℃~+155℃
R9 R39 R44 R49 R54 = 0603WAF4703T5E: LCSC Part Name: 470kΩ ±1% 100mW 厚膜电阻; Supplier Part: C23178; Manufacturer: UNI-ROYAL(厚声); Supplier Footprint: 0603; JLCPCB Part Class: Basic Part; Datasheet: https://item.szlcsc.com/datasheet/0603WAF4703T5E/23905.html; Supplier: LCSC; Type: Thick Film Resistor; Tolerance: ±1%; Power(Watts): 100mW; Voltage-Supply(Max): 75V; Temperature Coefficient: ±100ppm/℃; Operating Temperature: -55℃~+155℃
R10 R11 R13 R16 R18 R22 R26 R30 R33-R36 R40 R41 R45 R46 R50 R51 R59 = 0402WGF1003TCE: LCSC Part Name: 100kΩ ±1% 62.5mW 厚膜电阻; Supplier Part: C25741; Manufacturer: UNI-ROYAL(厚声); Supplier Footprint: 0402; JLCPCB Part Class: Basic Part; Datasheet: https://item.szlcsc.com/datasheet/0402WGF1003TCE/26484.html; Supplier: LCSC; Type: Thick Film Resistor; Tolerance: ±1%; Power(Watts): 62.5mW; Voltage-Supply(Max): 50V; Temperature Coefficient: ±100ppm/℃; Operating Temperature: -55℃~+155℃
R12 = 0402WGF1000TCE: LCSC Part Name: 100Ω ±1% 62.5mW 厚膜电阻; Supplier Part: C25076; Manufacturer: UNI-ROYAL(厚声); Supplier Footprint: 0402; JLCPCB Part Class: Basic Part; Datasheet: https://atta.szlcsc.com/upload/public/pdf/source/20200306/C422600_1E6D84923E4A46A82E41ADD87F860B5C.pdf; Supplier: LCSC; Type: Thick Film Resistors; Tolerance: ±1%; Temperature Coefficient: ±200ppm/℃; Operating Temperature Range: -55℃~+155℃
R14 = FRC0402F7503TS: LCSC Part Name: 750kΩ ±1% 62.5mW 厚膜电阻; Supplier Part: C2909381; Manufacturer: FOJAN(富捷); Supplier Footprint: 0402; JLCPCB Part Class: Extended Part; Datasheet: https://item.szlcsc.com/datasheet/FRC0402F7503TS/3186316.html; Supplier: LCSC; Type: Thick Film Resistor; Tolerance: ±1%; Power(Watts): 62.5mW; Voltage-Supply(Max): 50V; Temperature Coefficient: ±100ppm/℃; Operating Temperature: -55℃~+155℃
R15 = AC0402JR-073M6L: LCSC Part Name: 厚膜电阻 3.6MΩ ±5% 62.5mW; Supplier Part: C227369; Manufacturer: YAGEO(国巨); Supplier Footprint: 0402; JLCPCB Part Class: Extended Part; Datasheet: https://atta.szlcsc.com/upload/public/pdf/source/20191108/C230504_7FB43CAE7E86B3B2980C2491161B254C.pdf; Supplier: LCSC; Type: Thick Film Resistors; Tolerance: ±5%; Temperature Coefficient: ±100ppm/℃; Operating Temperature Range: -55℃~+155℃
U1 = AP2112K-3.3TRG1: Output Type:Fixed Voltage - Supply:6V Output Voltage:3.3V Output Voltage:3.3V Output Current:600mA Power Supply Rejection Ratio (PSRR):65dB@(1kHz) Voltage Dropout:250mV@(600mA) standby current:55uA Noise:50uVrms Features:Enable；Over Temperature Protection; LCSC Part Name: 输入6V 输出3.3V 600mA; Supplier Part: C51118; Manufacturer: DIODES(美台); Supplier Footprint: SOT-25-5; JLCPCB Part Class: Extended Part; Datasheet: https://item.szlcsc.com/datasheet/AP2112K-3.3TRG1/52131.html; Supplier: LCSC; Output Type: Fixed; Voltage - Supply: 6V; Output Voltage: 3.3V; Output Current: 600mA; Power Supply Rejection Ratio (PSRR): 65dB@(1kHz); Voltage Dropout: 250mV@(600mA); standby current: 55uA; Noise: 50uVrms; Features: Enable；Over Temperature Protection；Over Current Protection; Operating Temperature: -40℃~+85℃@(Ta); Output Configuration: Positive; Number of Outputs: 1
U2 U9 = MT3608: Function:Boost Output Type:Adjustable Voltage - Supply:2V~24V Voltage - Supply:2V~24V Output Voltage:- Output Voltage:- Output Current:2A Frequency - Switching:1.2MHz Frequency - Switching:1.2MHz Operating Temperature:-40℃~+85℃ Operating Temperature:-40℃~; LCSC Part Name: 老版本 高效1.2MHz 2A升压转换器; Supplier Part: C84817; Manufacturer: 西安航天民芯; Supplier Footprint: SOT-23-6; JLCPCB Part Class: Extended Part; Datasheet: https://item.szlcsc.com/datasheet/MT3608/85988.html; Supplier: LCSC; Function: Boost; Output Type: Adjustable; Voltage - Supply: 2V~24V; Output Current: 2A; Frequency - Switching: 1.2MHz; Operating Temperature: -40℃~+85℃; Synchronous Rectifier: No; Number of Outputs: 1; Topology: Boost; Quiescent Current: 100uA；1.6mA; Switch tube (built-in/external): Built-in
U4 = CN3163: The Chip Type:Charging IC Voltage - Supply:4.4V~6V Voltage - Supply:4.4V~6V Charge Current - Max:- Charging Saturation Voltage:4.2V Type of Battery:Lithium Battery Number of Cells:1 Number of Cells:1 Operating Temperature:-40℃~+85℃ Operating Temperature:-; LCSC Part Name: 可用太阳能板供电的锂电池充电管理芯片; Supplier Part: C559031; Manufacturer: CONSONANCE(上海如韵); Supplier Footprint: ESOP-8; JLCPCB Part Class: Extended Part; Datasheet: https://item.szlcsc.com/datasheet/CN3163/582671.html; Supplier: LCSC; The Chip Type: Charging IC; Voltage - Supply: 4.4V~6V; Charging Saturation Voltage: 4.2V; Type of Battery: Lithium Battery; Number of Cells: 1; Operating Temperature: -40℃~+85℃; Battery Temperature Detection: Support; Supply Current (Iq): 3uA
U5 = RV-3028-C7-32.768kHz-1ppm-TA-QC: Voltage - Supply:1.1V~5.5V Voltage - Supply:1.1V~5.5V; LCSC Part Name: RV-3028-C7 32.768kHz 1ppm TA QC; Supplier Part: C3019759; Manufacturer: Micro Crystal(瑞士微晶); Supplier Footprint: SMD3215-8P; JLCPCB Part Class: Extended Part; Datasheet: https://www.microcrystal.com/fileadmin/Media/Products/RTC/Datasheet/RV-3028-C7.pdf; Supplier: LCSC; Voltage - Supply: 1.1V~5.5V
U6 U7 = 1812L110PR: LCSC Part Name: 8V 1.1A 1812自恢复; Supplier Part: C163516; Manufacturer: Littelfuse(美国力特); Supplier Footprint: 1812; JLCPCB Part Class: Extended Part; Datasheet: https://item.szlcsc.com/datasheet/1812L110PR/174898.html; Supplier: LCSC; Voltage - Max: 8V; Current - Max: 100A; Hold Current: 1.1A; Trip Current: 2.2A; Power Dissipation: 800mW; Resistance - Initial (Ri) (Min): 40mΩ; Resistance - Post Trip (R1) (Max): 210mΩ; Time to Trip(Max): 300ms; Operating Temperature: -40℃~+85℃; Length: 4.73mm; Width: 3.41mm
U8 = TPL720F33-3TR: LCSC Part Name: 400 mA输出，超低静态电流LDO; Supplier Part: C2842389; Manufacturer: 3PEAK(思瑞浦); Supplier Footprint: SOT-23-3; JLCPCB Part Class: Extended Part; Datasheet: https://item.szlcsc.com/datasheet/TPL720F33-3TR/3027171.html; Supplier: LCSC; Output Type: Fixed; Voltage - Supply: 9V; Output Voltage: 3.3V; Output Current: 400mA; Power Supply Rejection Ratio (PSRR): 53dB@(1MHz); Voltage Dropout: 350mV@(400mA); standby current: 1.4uA; Noise: 90uVrms; Features: Enable；Over Current Protection；Soft Start；Over Temperature Protection; Operating Temperature: -40℃~+85℃@(Ta); Output Configuration: Positive
C34 C37 C40 C43 = CGA0603X5R475K250JT: LCSC Part Name: 4.7uF ±10% 25V; Supplier Part: C6119856; Manufacturer: HRE(芯声); Supplier Footprint: 0603; JLCPCB Part Class: Extended Part; Supplier: LCSC; Tolerance: ±10%; Voltage Rating: 25V; Temperature Coefficient: X5R
C35 C38 C41 C44 = CL05A104KA5NNNC: LCSC Part Name: 100nF ±10% 25V; Supplier Part: C100072; Manufacturer: SAMSUNG(三星); Supplier Footprint: 0402; JLCPCB Part Class: Extended Part; Datasheet: https://item.szlcsc.com/datasheet/CL05A104KA5NNNC/101286.html; Supplier: LCSC; Tolerance: ±10%; Voltage Rating: 25V; Temperature Coefficient: X5R
C36 C39 C42 C45 = CC0402KRX7R8BB222: LCSC Part Name: 2.2nF ±10% 25V; Supplier Part: C541386; Manufacturer: YAGEO(国巨); Supplier Footprint: 0402; JLCPCB Part Class: Extended Part; Datasheet: https://atta.szlcsc.com/upload/public/pdf/source/20200615/C541386_7B176CE5F84559F9CFB8AA143269F5F2.pdf; Supplier: LCSC; Tolerance: ±10%
C48 C51 C54 C57 = 0402B222K500NT: LCSC Part Name: 2.2nF ±10% 50V; Supplier Part: C1531; Manufacturer: FH(风华); Supplier Footprint: 0402; JLCPCB Part Class: Extended Part; Datasheet: https://item.szlcsc.com/datasheet/0402B222K500NT/1883.html; Supplier: LCSC; Tolerance: ±10%; Voltage Rating: 50V; Temperature Coefficient: X7R
Q5-Q8 = AO3400_C20628874: LCSC Part Name: 1个N沟道 耐压:30V 电流:5.8A; Supplier Part: C20628874; Manufacturer: FOSAN(富捷/富信); Supplier Footprint: SOT-23; JLCPCB Part Class: Extended Part; Datasheet: https://item.szlcsc.com/datasheet/AO3400/22043122.html; Supplier: LCSC; Number: 1 N-channel; Drain to Source Voltage: 30V; Current - Continuous Drain(Id): 5.8A
R17 R20 R21 R24 R25 R28 R29 R32 = RC0402FR-0722RL: LCSC Part Name: 厚膜电阻 22Ω ±1% 62.5mW; Supplier Part: C114765; Manufacturer: YAGEO(国巨); Supplier Footprint: 0402; JLCPCB Part Class: Extended Part; Datasheet: https://atta.szlcsc.com/upload/public/pdf/source/20180821/C275644_0D56F95EFF785E7D9A1FEF436B37DA78.pdf; Supplier: LCSC; Type: Thick Film Resistors; Tolerance: ±1%; Temperature Coefficient: ±100ppm/℃; Operating Temperature Range: -55℃~+155℃
R19 R23 R27 R31 = 0402WGF100JTCE: LCSC Part Name: 10Ω ±1% 62.5mW 厚膜电阻; Supplier Part: C25077; Manufacturer: UNI-ROYAL(厚声); Supplier Footprint: 0402; JLCPCB Part Class: Basic Part; Datasheet: https://item.szlcsc.com/datasheet/0402WGF100JTCE/25820.html; Supplier: LCSC; Type: Thick Film Resistor; Tolerance: ±1%; Power(Watts): 62.5mW; Voltage-Supply(Max): 50V; Temperature Coefficient: ±200ppm/℃; Operating Temperature: -55℃~+155℃
U10 U11 = TPMCP6022T-I/SN: LCSC Part Name: 运算放大器; Supplier Part: C2937047; Manufacturer: TECH PUBLIC(台舟); Supplier Footprint: SOP-8; JLCPCB Part Class: Extended Part; Datasheet: https://item.szlcsc.com/datasheet/TPMCP6022T-I%252FSN/3290394.html; Supplier: LCSC; Number of Channels: Dual; Maximum Power Supply Range (Vdd-Vss): 7V; Vos - Input Offset Voltage: 5mV; Input Offset Voltage Drift(Vos TC): 6uV/℃; Slew Rate: 4.5V/us; Ib - Input Bias Current: 100pA; Noise density(eN): 30nV/√Hz@1kHz; Common Mode Rejection Ratio(CMRR): 80dB; Operating Temperature: -40℃~+125℃; Single supply: 2.2V~5.5V
U12-U15 = LM311DR: LCSC Part Name: LMx11 四通道差分比较器; Supplier Part: C12597; Manufacturer: TI(德州仪器); Supplier Footprint: SOIC-8; JLCPCB Part Class: Extended Part; Datasheet: https://www.ti.com/cn/lit/gpn/lm311; Supplier: LCSC; Number of Channels: 1; Vos - Input Offset Voltage: 2mV; Ib - Input Bias Current: 100nA; Propagation Delay Time: 165ns; Output Type: TTL；CMOS; Quiescent Current: 5.1mA; Operating Temperature: 0℃~+70℃

## Nets
2V5_REF: C46.2 C47.2 R33.1 R34.2 R35.1 R37.1 R40.1 R42.1 R45.1 R47.1 R50.1 R52.1 U12.3(IN-) U13.3(IN-) U14.3(IN-) U15.3(IN-)
3V3_SYS: C17.2 C18.2 C59.2 C60.2 C61.2 F3.3 F3.4 R38.2 R43.2 R48.2 R53.2 R55.1 R56.1 R57.1 R60.1 U1.5(VOUT) U16.3(3V3) U17.2
5V_SYS: C23.2 C25.2 C49.2 C50.2 C53.2 C55.2 C56.2 C58.2 D3.1(C) R14.2 R33.2 U10.8(+VS) U11.8(+VS) U12.6(BALSTRB) U12.8(VCC+) U13.6(BALSTRB) U13.8(VCC+) U14.6(BALSTRB) U14.8(VCC+) U15.6(BALSTRB) U15.8(VCC+)
22V_SYS: C31.2 C33.2 C34.2 C35.2 C37.2 C38.2 C40.2 C41.2 C43.2 C44.2 D4.1(C) R15.2 R19.1 R23.1 R27.1 R31.1
GND: B1.2 C3.1 C4.1 C5.1 C6.1 C7.1 C8.1 C9.1 C10.1 C11.1 C12.1 C13.1 C15.1 C16.1 C17.1 C18.1 C21.1 C23.1 C24.1 C25.1 C30.1 C31.1 C32.1 C33.1 C34.1 C35.1 C36.1 C37.1 C38.1 C39.1 C40.1 C41.1 C42.1 C43.1 C44.1 C45.1 C46.1 C47.1 C49.1 C50.1 C53.1 C55.1 C56.1 C58.1 C59.1 C60.1 C61.1 C62.1 CN1.2 CN2.2 D1.1(A) Q1.1(G) Q3.2(S) Q4.2(S) Q5.2(S) Q6.2(S) Q7.2(S) Q8.2(S) R2.1 R3.1 R6.2 R13.1 R16.1 R18.2 R22.2 R26.2 R30.2 R34.1 R59.1 SW1.2 SW2.1 SW3.1 U1.2(GND) U2.2(GND) U4.3(GND) U5.5(VSS) U8.1(GND) U9.2(GND) U10.4(-VS) U11.4(-VS) U12.1(EMIT/OUT) U12.4(VCC-) U13.1(EMIT/OUT) U13.4(VCC-) U14.1(EMIT/OUT) U14.4(VCC-) U15.1(EMIT/OUT) U15.4(VCC-) U17.1
CRG: R5.1 U4.7(CHRG#)
DNE: R4.1 U4.6(DONE#)
I2C_SCL: F3.1 U5.3(SCL) U16.18(IO4)
I2C_SDA: F3.2 U5.4(SDA) U16.19(IO5)
INT_RTC: Q3.1(G) R11.2 U5.2(INT#)
KEEP_ALIVE: C9.2 C10.2 C12.2 C13.2 F2.3 F2.4 R11.1 U5.7(VDD) U8.2(OUT)
MCU_RX_E: R48.1 R49.2 RN2.3 U14.7(COL/OUT)
MCU_RX_N: R38.1 R39.2 RN2.1 U12.7(COL/OUT)
MCU_RX_S: R43.1 R44.2 RN2.2 U13.7(COL/OUT)
MCU_RX_W: R53.1 R54.2 RN2.4 U15.7(COL/OUT)
PROG_BOOT: R56.2 SW3.2 U16.23(IO9) U17.6
PROG_EN: C62.2 R55.2 SW2.2 U16.8(EN) U17.5
PWR_HOLD: Q4.1(G) R59.2 R60.2 U16.22(IO8)
R_RX_E: RN2.6 U16.26(IO18)
R_RX_N: RN2.8 U16.21(IO7)
R_RX_S: RN2.7 U16.16(IO10)
R_RX_W: RN2.5 U16.27(IO19)
R_TX_E: RN1.6 U16.6(IO3)
R_TX_N: RN1.8 U16.12(IO0)
R_TX_S: RN1.7 U16.13(IO1)
R_TX_W: RN1.5 U16.20(IO6)
RAW_BAT: C7.2 C8.2 C14.2 D1.2(K) Q2.2(S) R10.2 U6.2 U7.2 U8.3(IN)
RX: U16.30(RXD0) U17.4
RX_OP_E: R46.1 R49.1 U11.1(OUTA) U14.2(IN+)
RX_OP_N: R36.1 R39.1 U10.1(OUTA) U12.2(IN+)
RX_OP_S: R41.1 R44.1 U10.7(OUTB) U13.2(IN+)
RX_OP_W: R51.1 R54.1 U11.7(OUTB) U15.2(IN+)
SCL: F2.1
SDA: F2.2
SYS_GATE: C14.1 Q2.1(G) R10.1 R12.2 SW1.1
TX: U16.31(TXD0) U17.3
TX_PULSE_E: R29.1 R30.1 RN1.3
TX_PULSE_N: R17.1 R18.1 RN1.1
TX_PULSE_S: R21.1 R22.1 RN1.2
TX_PULSE_W: R25.1 R26.1 RN1.4
VBU: B1.1 R9.2
VSYS: C15.2 C16.2 C21.2 C24.2 C30.2 C32.2 L1.2 L2.2 Q2.3(D) U1.1(VIN) U1.3(EN) U2.4(EN) U2.5(IN) U9.4(EN) U9.5(IN)
XDUC_E+: C54.1 CN6.1 R31.2
XDUC_E-: CN6.2 Q8.3(D) R32.2
XDUC_N+: C48.1 CN3.1 R19.2
XDUC_N-: CN3.2 Q5.3(D) R20.2
XDUC_S+: C51.1 CN4.1 R23.2
XDUC_S-: CN4.2 Q6.3(D) R24.2
XDUC_W+: C57.1 CN5.1 R27.2
XDUC_W-: CN5.2 Q7.3(D) R28.2
$2N1524: R2.2 U4.2(ISET)
$2N1662: R3.2 U4.1(TEMP)
$2N2320: LED1.2(A) R5.2
$2N2322: LED2.2(A) R4.2
$2N2460: C4.2 C6.2 LED1.1(K) LED2.1(K) U4.5(BAT) U4.8(FB) U6.1
$2N2504: C3.2 C5.2 F1.2 U4.4(VIN)
$2N2549: CN2.1 F1.1
$2N2672: CN1.1 Q1.2(S)
$2N2674: Q1.3(D) U7.1
$2N3282: R6.1 U5.8(EVI)
$2N3409: C11.2 R9.1 U5.6(VBACKUP)
$2N4324: Q3.3(D) Q4.3(D) R12.1
$2N5981: R13.2 R14.1 U2.3(FB)
$2N6268: D3.2(A) L1.1 U2.1(SW)
$2N6641: R15.1 R16.2 U9.3(FB)
$2N6648: D4.2(A) L2.1 U9.1(SW)
$4N255: Q5.1(G) R17.2
$4N776: C36.2 R20.1
$4N1187: Q6.1(G) R21.2
$4N1189: C39.2 R24.1
$4N1560: Q7.1(G) R25.2
$4N1587: C42.2 R28.1
$4N1945: Q8.1(G) R29.2
$4N1972: C45.2 R32.1
$4N2651: C48.2 R35.2 U10.3(INA+)
$4N2808: R36.2 R37.2 U10.2(INA-)
$4N3695: R41.2 R42.2 U10.6(INB-)
$4N3699: C51.2 R40.2 U10.5(INB+)
$4N4152: C54.2 R45.2 U11.3(INA+)
$4N4174: R46.2 R47.2 U11.2(INA-)
$4N4575: C57.2 R50.2 U11.5(INB+)
$4N4586: R51.2 R52.2 U11.6(INB-)
$5N1299: R57.2 U16.5(IO2)

Not connected (* = marked no-connect by the designer): CN1 3 4; CN2 3 4; CN3 3 4; CN4 3 4; CN5 3 4; CN6 3 4; U1 4(NC)*; U2 6(NC)*; U4 9(PAD); U5 1(CLKOUT)*; U9 6(NC)*; U12 5(BALANCE)*; U13 5(BALANCE)*; U14 5(BALANCE)*; U15 5(BALANCE)*; U16 1(GND) 2(GND) 4(NC) 7(NC) 9(NC) 10(NC) 11(GND) 14(GND) 15(NC) 17(NC) 24(NC) 25(NC) 28(NC) 29(NC) 32(NC) 33(NC) 34(NC) 35(NC) 36(GND) 37(GND) 38(GND) 39(GND) 40(GND) 41(GND) 42(GND) 43(GND) 44(GND) 45(GND) 46(GND) 47(GND) 48(GND) 49(GND) 50(GND) 51(GND) 52(GND) 53(GND); U17 7 8

## Notes on the sheets
sheet 1
- ULTRASONIC WIND
- TX DRIVERS
- RTC +
  POWER SWITCHING
- SOLAR CHARGER
- RX DRIVERS
- SENSOR PORT
    INTERFACE
- MCU
- MUX
- ADS1115
- LIPO
- POWER RAILS
- PORT SWITCHING
- 4 X PORTS
- PAR
sheet 2
- RTC
- SOLAR CHARGING
- 3.3 V
- 5 V
- INPUT PROTECTION
- KEEP_ALIVE
- POWER SWITCHING LOGIC
- 22 V
sheet 3
- TX
- RX
- TX_N_S
- TX_W_E
- TX_S_N
- TX_E_W
- REFERENCE 2.5 V

# Board PCB1
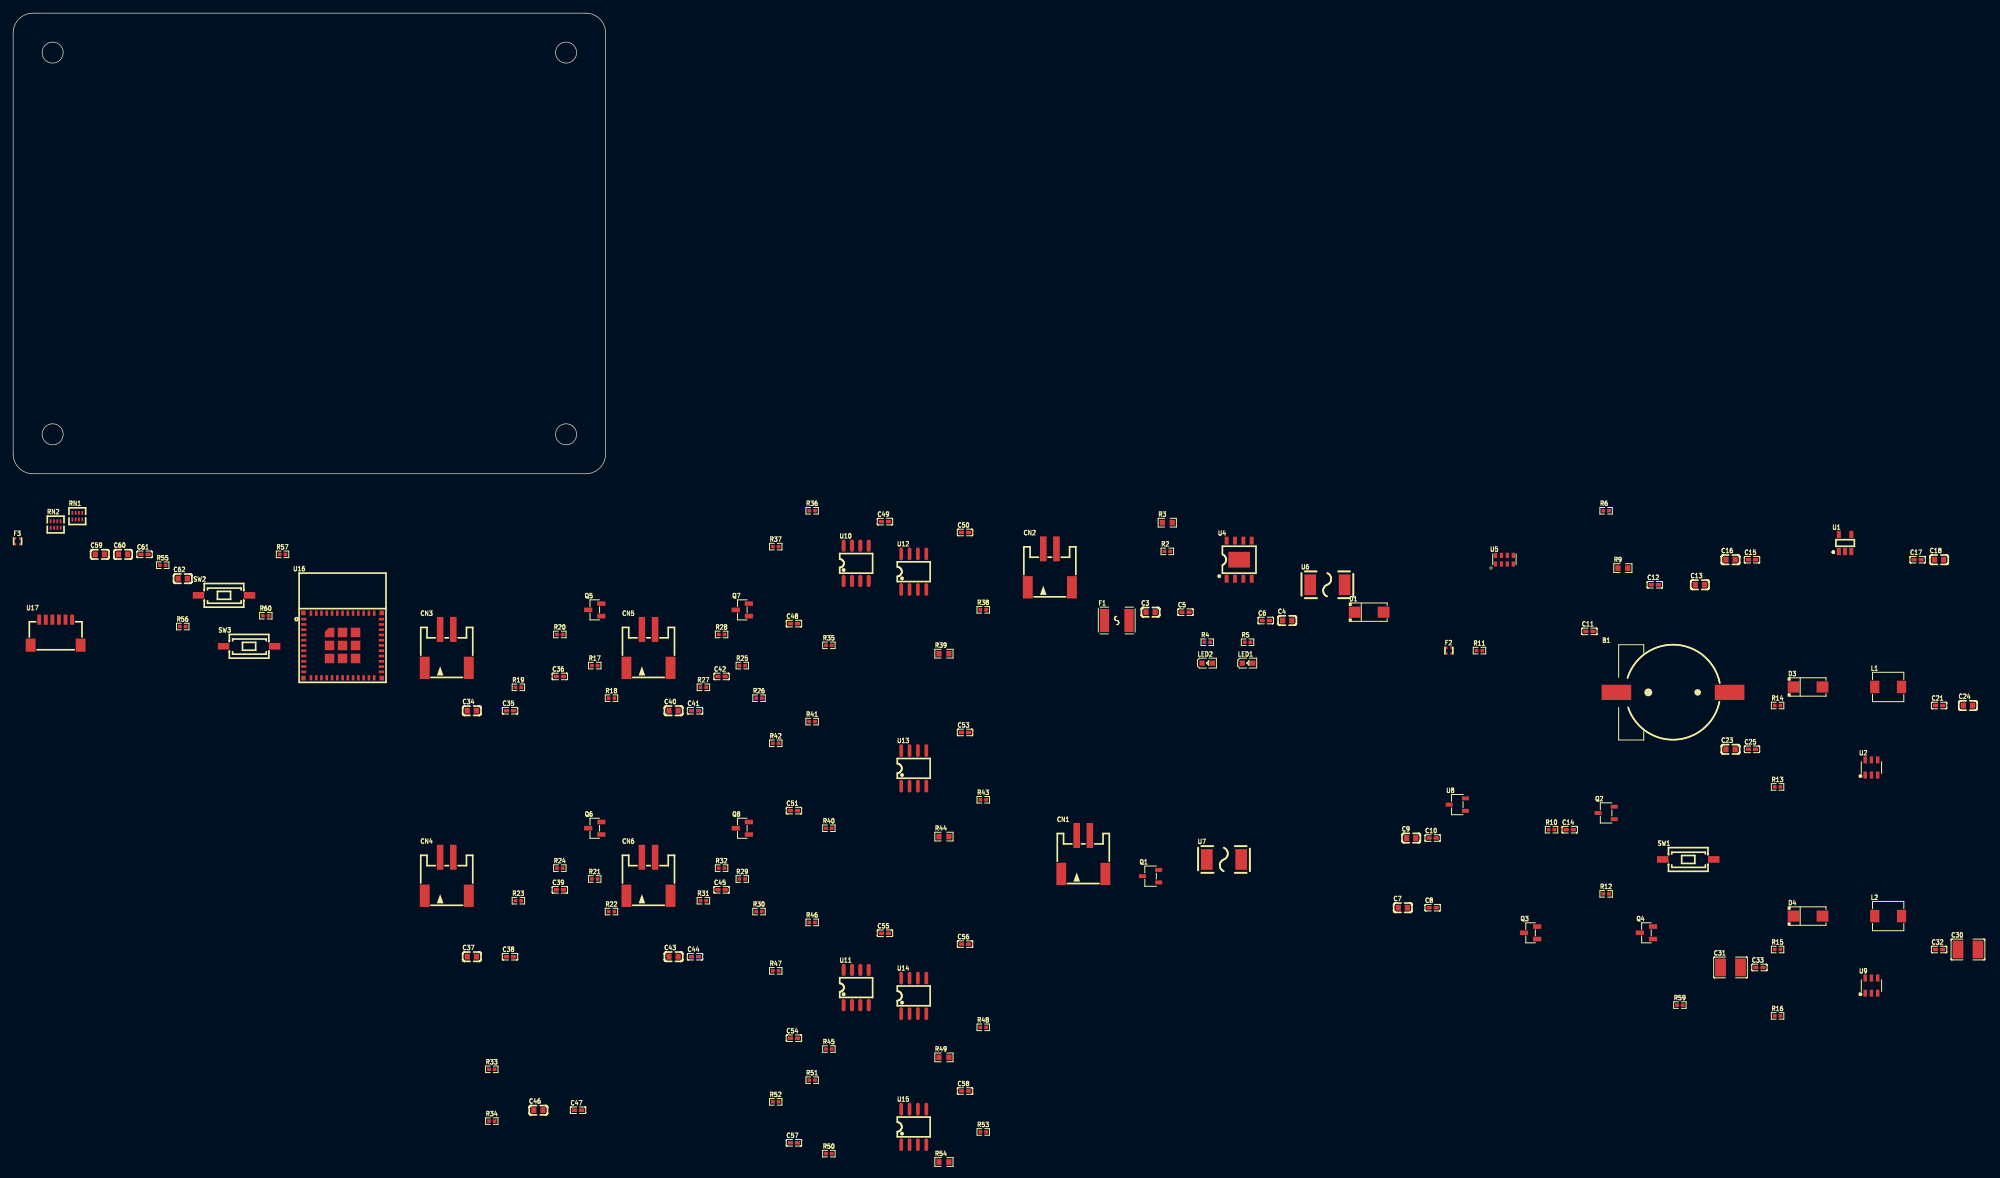
[diagram p5: board, top side]
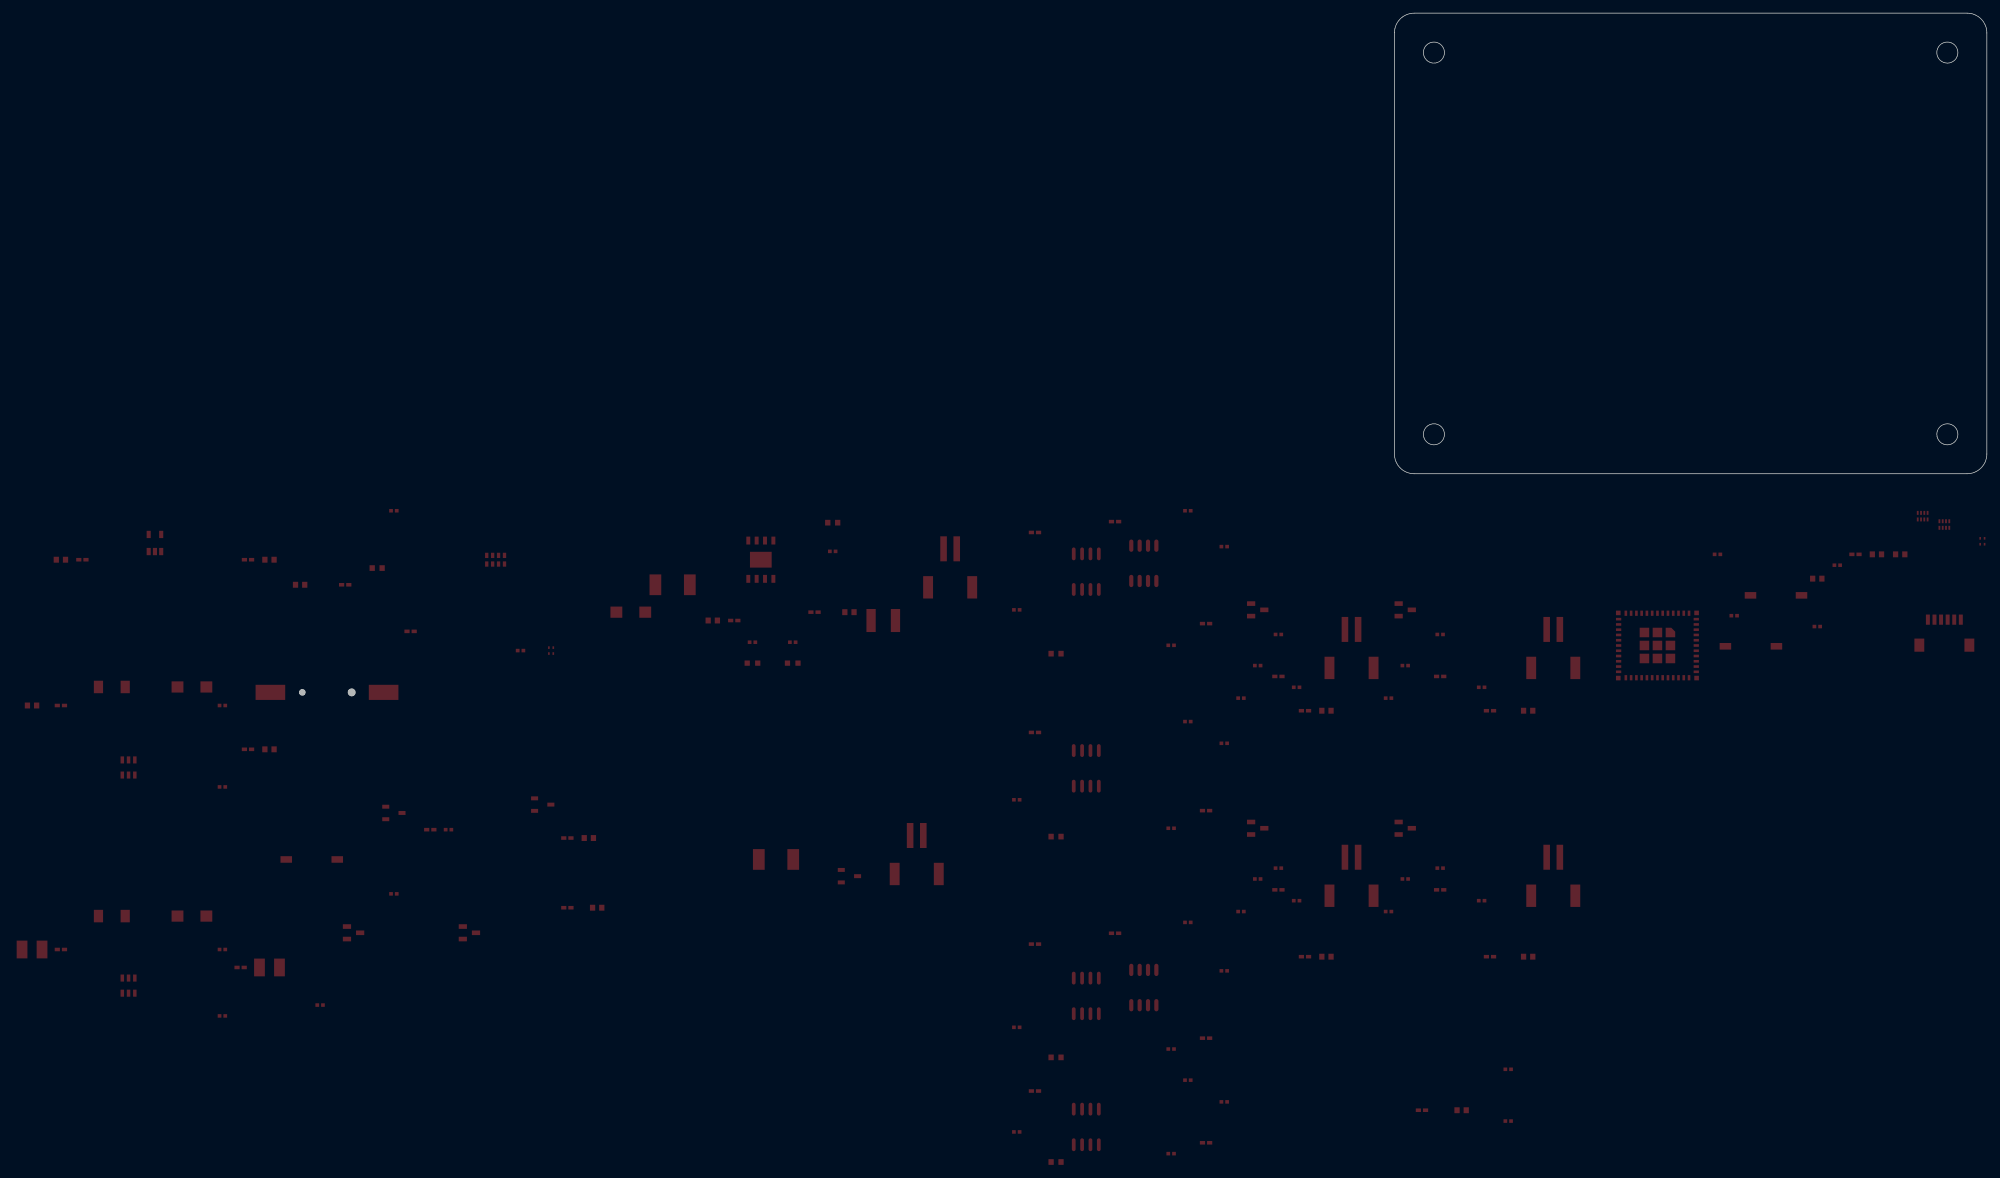
[diagram p6: board, bottom side, seen from below]

Outline 256.41 x 103.82 mm; copper layers: Top Layer, Bottom Layer. Coordinates in mm from the lower left corner of the outline.
Outline path: circle c6,97.83 r1.6 ; circle c6,39.82 r1.6 ; circle c84,97.83 r1.6 ; circle c84,39.82 r1.6 ; 0,100.82 0,36.82 arc(0.88,34.7) 3,33.82 87,33.82 arc(89.12,34.7) 90,36.82 90,100.82 arc(89.12,102.94) 87,103.82 3,103.82 arc(0.88,102.94) 0,100.82
Stack: Top Layer 0.035mm / Dielectric1 1.51mm FR4 er 4.5 / Bottom Layer 0.035mm

## Design rules (mm)
template: JLCPCB Capability(Two Layers Board)
spacing copperThickness1oz (default): track to track 0.102, other pairs 0.152 to 0.3
spacing copperThickness2oz: track to track 0.203, other pairs 0.152 to 0.3
track width copperThickness1oz (default): min 0.127, default 0.254, max 2.54
track width copperThickness2oz: min 0.203, default 0.254, max 2.54
differential pair differentialPair (default): width min 0.127, default 0.254, max 2.54; gap min 0.152, default 0.152
via viaSize (default): diameter min 0.5, default 0.61, max 10; hole min 0.3, default 0.305, max 6.3

## Placement (name value [footprint] x y rotation side)
B1  CR1220-2  [BAT-SMD_CR1220-2]  252.16 0.59 0 top
C3  10uF  [C0603]  172.8 12.78 0 top
C4  10uF  [C0603]  193.56 11.51 0 top
C5  100nF  [C0402]  178.1 12.78 0 top
C6  100nF  [C0402]  190.29 11.51 0 top
C7  10uF  [C0603]  211.12 -32.13 0 top
C8  100nF  [C0402]  215.65 -32.13 0 top
C9  10uF  [C0603]  212.39 -21.54 0 top
C10  100nF  [C0402]  215.65 -21.54 0 top
C11  100nF  [C0402]  239.46 9.86 0 top
C12  100nF  [C0402]  249.4 16.95 0 top
C13  10uF  [C0603]  256.25 16.95 0 top
C14  33nF  [C0402]  236.48 -20.27 0 top
C15  100nF  [C0402]  264.17 20.76 0 top
C16  10uF  [C0603]  260.91 20.76 0 top
C17  100nF  [C0402]  289.33 20.76 0 top
C18  10uF  [C0603]  292.59 20.76 0 top
C21  100nF  [C0402]  292.59 -1.4 0 top
C23  22uF  [C0603]  260.91 -8.06 0 top
C24  22uF  [C0603]  296.98 -1.4 0 top
C25  100nF  [C0402]  264.17 -8.06 0 top
C30  22uF  [C1210]  296.98 -38.48 0 top
C31  22uF  [C1210]  260.91 -41.21 0 top
C32  100nF  [C0402]  292.59 -38.48 0 top
C33  100nF  [C0402]  265.29 -41.21 0 top
C34  4.7uF  [C0603]  69.68 -2.2 0 top
C35  100nF  [C0402]  75.48 -2.2 0 top
C36  2.2nF  [C0402]  83.05 3.02 0 top
C37  4.7uF  [C0603]  69.68 -39.58 0 top
C38  100nF  [C0402]  75.48 -39.58 0 top
C39  2.2nF  [C0402]  83.05 -29.42 0 top
C40  4.7uF  [C0603]  100.33 -2.2 0 top
C41  100nF  [C0402]  103.59 -2.2 0 top
C42  2.2nF  [C0402]  107.63 3.02 0 top
C43  4.7uF  [C0603]  100.33 -39.58 0 top
C44  100nF  [C0402]  103.59 -39.58 0 top
C45  2.2nF  [C0402]  107.63 -29.42 0 top
C46  10uF  [C0603]  79.79 -62.91 0 top
C47  100nF  [C0402]  85.82 -62.91 0 top
C48  2.2nF  [C0402]  118.62 11.05 0 top
C49  100nF  [C0402]  132.44 26.55 0 top
C50  100nF  [C0402]  144.61 24.9 0 top
C51  2.2nF  [C0402]  118.62 -17.38 0 top
C53  100nF  [C0402]  144.61 -5.5 0 top
C54  2.2nF  [C0402]  118.62 -51.96 0 top
C55  100nF  [C0402]  132.44 -36.02 0 top
C56  100nF  [C0402]  144.61 -37.67 0 top
C57  2.2nF  [C0402]  118.62 -67.86 0 top
C58  100nF  [C0402]  144.61 -59.99 0 top
C59  10uF  [C0603]  13.16 21.57 0 top
C60  1uF  [C0603]  16.7 21.57 0 top
C61  100nF  [C0402]  19.96 21.57 0 top
C62  1uF  [C0603]  25.76 17.88 0 top
CN1  S2B-PH-SM4-TB(LF)(SN)  [CONN-SMD_P2.00_S2B-PH-SM4-TB-LF-SN]  162.58 -24.08 0 top
CN2  S2B-PH-SM4-TB(LF)(SN)  [CONN-SMD_P2.00_S2B-PH-SM4-TB-LF-SN]  157.5 19.49 0 top
CN3  S2B-PH-SM4-TB(LF)(SN)  [CONN-SMD_P2.00_S2B-PH-SM4-TB-LF-SN]  65.87 7.24 0 top
CN4  S2B-PH-SM4-TB(LF)(SN)  [CONN-SMD_P2.00_S2B-PH-SM4-TB-LF-SN]  65.87 -27.39 0 top
CN5  S2B-PH-SM4-TB(LF)(SN)  [CONN-SMD_P2.00_S2B-PH-SM4-TB-LF-SN]  96.52 7.24 0 top
CN6  S2B-PH-SM4-TB(LF)(SN)  [CONN-SMD_P2.00_S2B-PH-SM4-TB-LF-SN]  96.52 -27.39 0 top
D1  SMAJ5.0A  [SMA_L4.4-W2.6-LS5.0-R-RD]  206.01 12.78 0 top
D3  SS14  [SMA_L4.4-W2.6-LS5.0-RD]  272.69 1.42 0 top
D4  SS14  [SMA_L4.4-W2.6-LS5.0-RD]  272.69 -33.4 0 top
F1  1812L050PR  [F1812]  167.66 11.51 0 top
F2  4.7kΩ  [RES-ARRAY-SMD_0404-4P-L1.0-W1.0-BL]  218.12 6.94 0 top
F3  4.7kΩ  [RES-ARRAY-SMD_0404-4P-L1.0-W1.0-BL]  0.68 23.56 0 top
L1  22uH  [IND-SMD_L4.6-W4.2_SMMS0420]  284.85 1.42 0 top
L2  22uH  [IND-SMD_L4.6-W4.2_SMMS0420]  284.85 -33.4 0 top
LED1  KT-0603R  [LED0603-RD]  187.53 5.04 0 top
LED2  KT-0603G  [LED0603-RD]  181.41 5.04 0 top
Q1  AO3407A  [SOT-23-3_L2.9-W1.6-P1.90-LS2.8-BR]  172.8 -27.34 0 top
Q2  AO3407A  [SOT-23-3_L2.9-W1.6-P1.90-LS2.8-BR]  242 -17.73 0 top
Q3  2N7002  [SOT-23-3_L2.9-W1.3-P1.90-LS2.4-BR]  230.53 -35.94 0 top
Q4  2N7002  [SOT-23-3_L2.9-W1.3-P1.90-LS2.4-BR]  248.13 -35.94 0 top
Q5  AO3400  [SOT-23-3_L2.9-W1.3-P1.90-LS2.4-BR]  88.36 13.14 0 top
Q6  AO3400  [SOT-23-3_L2.9-W1.3-P1.90-LS2.4-BR]  88.36 -20.06 0 top
Q7  AO3400  [SOT-23-3_L2.9-W1.3-P1.90-LS2.4-BR]  110.77 13.14 0 top
Q8  AO3400  [SOT-23-3_L2.9-W1.3-P1.90-LS2.4-BR]  110.77 -20.06 0 top
R2  4.7kΩ  [R0402]  175.34 22.03 0 top
R3  0Ω  [R0603]  175.34 26.39 0 top
R4  2.2kΩ  [R0402]  181.41 8.21 0 top
R5  2.2kΩ  [R0402]  187.53 8.21 0 top
R6  10kΩ  [R0402]  242 28.2 0 top
R9  470kΩ  [R0603]  244.54 19.49 0 top
R10  100kΩ  [R0402]  233.71 -20.27 0 top
R11  100kΩ  [R0402]  222.76 6.94 0 top
R12  100Ω  [R0402]  242 -30.03 0 top
R13  100kΩ  [R0402]  268.06 -13.78 0 top
R14  750kΩ  [R0402]  268.06 -1.4 0 top
R15  3.6MΩ  [R0402]  268.06 -38.48 0 top
R16  100kΩ  [R0402]  268.06 -48.58 0 top
R17  22Ω  [R0402]  88.36 4.66 0 top
R18  100kΩ  [R0402]  90.9 -0.28 0 top
R19  10Ω  [R0402]  76.75 1.37 0 top
R20  22Ω  [R0402]  83.05 9.4 0 top
R21  22Ω  [R0402]  88.36 -27.77 0 top
R22  100kΩ  [R0402]  90.9 -32.72 0 top
R23  10Ω  [R0402]  76.75 -31.07 0 top
R24  22Ω  [R0402]  83.05 -26.12 0 top
R25  22Ω  [R0402]  110.77 4.66 0 top
R26  100kΩ  [R0402]  113.31 -0.28 0 top
R27  10Ω  [R0402]  104.86 1.37 0 top
R28  22Ω  [R0402]  107.63 9.4 0 top
R29  22Ω  [R0402]  110.77 -27.77 0 top
R30  100kΩ  [R0402]  113.31 -32.72 0 top
R31  10Ω  [R0402]  104.86 -31.07 0 top
R32  22Ω  [R0402]  107.63 -26.12 0 top
R33  100kΩ  [R0402]  72.72 -56.69 0 top
R34  100kΩ  [R0402]  72.72 -64.56 0 top
R35  100kΩ  [R0402]  123.92 7.75 0 top
R36  100kΩ  [R0402]  121.38 28.2 0 top
R37  10kΩ  [R0402]  115.85 22.75 0 top
R38  4.7kΩ  [R0402]  147.38 13.14 0 top
R39  470kΩ  [R0603]  141.4 6.48 0 top
R40  100kΩ  [R0402]  123.92 -20.06 0 top
R41  100kΩ  [R0402]  121.38 -3.85 0 top
R42  10kΩ  [R0402]  115.85 -7.14 0 top
R43  4.7kΩ  [R0402]  147.38 -15.73 0 top
R44  470kΩ  [R0603]  141.4 -21.33 0 top
R45  100kΩ  [R0402]  123.92 -53.61 0 top
R46  100kΩ  [R0402]  121.38 -34.37 0 top
R47  10kΩ  [R0402]  115.85 -41.73 0 top
R48  4.7kΩ  [R0402]  147.38 -50.31 0 top
R49  470kΩ  [R0603]  141.4 -54.88 0 top
R50  100kΩ  [R0402]  123.92 -69.51 0 top
R51  100kΩ  [R0402]  121.38 -58.34 0 top
R52  10kΩ  [R0402]  115.85 -61.64 0 top
R53  4.7kΩ  [R0402]  147.38 -66.21 0 top
R54  470kΩ  [R0603]  141.4 -70.78 0 top
R55  10kΩ  [R0402]  22.72 19.92 0 top
R56  10kΩ  [R0402]  25.76 10.6 0 top
R57  10kΩ  [R0402]  40.92 21.57 0 top
R59  100kΩ  [R0402]  253.21 -46.93 0 top
R60  10kΩ  [R0402]  38.38 12.25 0 top
RN1  100Ω  [RES-ARRAY-SMD_0804-8P-L2.0-W1.0-BL]  9.75 27.37 0 top
RN2  100Ω  [RES-ARRAY-SMD_0804-8P-L2.0-W1.0-BL]  6.45 26.1 0 top
SW1  HX-3x6x2.5-X SMD tact Switch  [SW-SMD_HX-3X6X2.5-X]  254.48 -24.8 0 top
SW2  HX-3x6x2.5-X SMD tact Switch  [SW-SMD_HX-3X6X2.5-X]  32.03 15.34 0 top
SW3  HX-3x6x2.5-X SMD tact Switch  [SW-SMD_HX-3X6X2.5-X]  35.84 7.6 0 top
U1  AP2112K-3.3TRG1  [SOT-25-5_L2.9-W1.6-P0.95-LS2.8-BL]  278.31 23.3 0 top
U2  MT3608  [SOT-23-6_L2.9-W1.6-P0.95-LS2.8-BL]  282.31 -10.82 0 top
U4  CN3163  [ESOP-8_L4.9-W3.9-P1.27-LS6.0-BL-EP]  186.26 20.76 0 top
U5  RV-3028-C7-32.768kHz-1ppm-TA-QC  [OSC-SMD_8P-L3.2-W1.5-P0.90-BL]  226.55 20.76 0 top
U6  1812L110PR  [FUSE-SMD_L4.7-W3.4]  199.66 16.95 0 top
U7  1812L110PR  [FUSE-SMD_L4.7-W3.4]  183.95 -24.8 0 top
U8  TPL720F33-3TR  [SOT-23-3_L2.9-W1.6-P1.90-LS2.8-BR]  219.39 -16.46 0 top
U9  MT3608  [SOT-23-6_L2.9-W1.6-P0.95-LS2.8-BL]  282.31 -43.97 0 top
U10  TPMCP6022T-I/SN  [SOP-8_L4.9-W3.9-P1.27-LS6.0-BL]  128.07 20.21 0 top
U11  TPMCP6022T-I/SN  [SOP-8_L4.9-W3.9-P1.27-LS6.0-BL]  128.07 -44.27 0 top
U12  LM311DR  [SOIC-8_L5.0-W4.0-P1.27-LS6.0-BL]  136.82 18.94 0 top
U13  LM311DR  [SOIC-8_L5.0-W4.0-P1.27-LS6.0-BL]  136.82 -10.95 0 top
U14  LM311DR  [SOIC-8_L5.0-W4.0-P1.27-LS6.0-BL]  136.82 -45.54 0 top
U15  LM311DR  [SOIC-8_L5.0-W4.0-P1.27-LS6.0-BL]  136.82 -65.45 0 top
U16  2.4GHz  [WIFIM-SMD_ESP32-C3-MINI-1]  50.04 7.72 0 top
U17  SM06B-SRSS-TB(LF)(SN)  [CONN-SMD_SM06B-SRSS-TB-LF-SN]  6.45 9.71 0 top

## Footprints (pads in the part's own frame, mm; a bottom-side part is the same pattern mirrored in y, then rotated)
BAT-SMD_CR1220-2
  rect 4.5x2.3 smd: 1(-8.6,0) 2(8.6,0)
C0402
  rect 0.79x0.54 smd: 1(-0.545,0) 2(0.545,0)
C0603
  rect 0.8x0.9 smd: 1(-0.7,0) 2(0.7,0)
C1210
  rect 1.635x2.7 smd: 1(-1.518,0) 2(1.518,0)
CONN-SMD_P2.00_S2B-PH-SM4-TB-LF-SN
  rect 1x3.8 smd: 1(-1,2.925) 2(1,2.925)
  rect 1.5x3.4 smd: 3(3.35,-2.925) 4(-3.35,-2.925)
CONN-SMD_SM06B-SRSS-TB-LF-SN
  rect 0.6x1.55 smd: 1(-2.5,1.938) 2(-1.5,1.938) 3(-0.5,1.938) 4(0.5,1.938) 5(1.5,1.938) 6(2.5,1.938)
  rect 1.5x2 smd: 7(3.8,-1.938) 8(-3.8,-1.938)
ESOP-8_L4.9-W3.9-P1.27-LS6.0-BL-EP
  rect 0.6x1.2 smd: 1(-1.905,-2.909) 2(-0.635,-2.909) 3(0.635,-2.909) 4(1.905,-2.909) 5(1.905,2.909) 6(0.635,2.909) 7(-0.635,2.909) 8(-1.905,2.909)
  rect 3.3x2.4 smd: 9(0,0)
F1812
  rect 1.407x3.499 smd: 1(-1.853,0) 2(1.853,0)
FUSE-SMD_L4.7-W3.4
  rect 1.78x3.15 smd: 1(-2.615,0) 2(2.615,0)
IND-SMD_L4.6-W4.2_SMMS0420
  rect 1.4x1.9 smd: 1(2.032,0) 2(-2.032,0)
LED0603-RD
  rect 0.8x0.8 smd: 1(-0.799,0) 2(0.799,0)
OSC-SMD_8P-L3.2-W1.5-P0.90-BL
  rect 0.504x0.8 smd: 1(-1.35,-0.657) 2(-0.45,-0.657) 3(0.45,-0.657) 4(1.35,-0.657) 5(1.35,0.657) 6(0.45,0.657) 7(-0.45,0.657) 8(-1.35,0.657)
R0402
  rect 0.566x0.54 smd: 1(-0.433,0) 2(0.433,0)
R0603
  rect 0.806x0.864 smd: 1(-0.753,0) 2(0.753,0)
RES-ARRAY-SMD_0404-4P-L1.0-W1.0-BL
  rect 0.25x0.4 smd: 1(-0.335,-0.45) 2(0.335,-0.45) 3(0.335,0.45) 4(-0.335,0.45)
RES-ARRAY-SMD_0804-8P-L2.0-W1.0-BL
  rect 0.275x0.6 smd: 1(-0.75,-0.5) 2(-0.25,-0.5) 3(0.25,-0.5) 4(0.75,-0.5) 5(0.75,0.5) 6(0.25,0.5) 7(-0.25,0.5) 8(-0.75,0.5)
SMA_L4.4-W2.6-LS5.0-R-RD
  rect 1.8x1.7 smd: 1(2.192,0) 2(-2.192,0)
SMA_L4.4-W2.6-LS5.0-RD
  rect 1.8x1.7 smd: 1(-2.192,0) 2(2.192,0)
SOIC-8_L5.0-W4.0-P1.27-LS6.0-BL
  oval 0.569x1.95 smd: 1(-1.905,-2.705) 2(-0.635,-2.705) 3(0.635,-2.705) 4(1.905,-2.705) 5(1.905,2.705) 6(0.635,2.705) 7(-0.635,2.705) 8(-1.905,2.705)
SOP-8_L4.9-W3.9-P1.27-LS6.0-BL
  oval 0.63x1.865 smd: 1(-1.905,-2.683) 2(-0.635,-2.683) 3(0.635,-2.683) 4(1.905,-2.683) 5(1.905,2.683) 6(0.635,2.683) 7(-0.635,2.683) 8(-1.905,2.683)
SOT-23-3_L2.9-W1.3-P1.90-LS2.4-BR
  rect 1.25x0.7 smd: 1(1,-0.95) 2(1,0.95) 3(-1,0)
SOT-23-3_L2.9-W1.6-P1.90-LS2.8-BR
  rect 1.07x0.6 smd: 1(1.235,-0.95) 2(1.235,0.95) 3(-1.235,0)
SOT-23-6_L2.9-W1.6-P0.95-LS2.8-BL
  rect 0.532x1.072 smd: 1(-0.95,-1.149) 2(0,-1.149) 3(0.95,-1.149) 4(0.95,1.149) 5(0,1.149) 6(-0.95,1.149)
SOT-25-5_L2.9-W1.6-P0.95-LS2.8-BL
  rect 0.623x1.105 smd: 1(-0.95,-1.3) 2(-0.001,-1.3) 3(0.95,-1.3) 4(0.95,1.3) 5(-0.95,1.3)
SW-SMD_HX-3X6X2.5-X
  rect 1.75x1 smd: 1(-3.875,0) 2(3.875,0)
WIFIM-SMD_ESP32-C3-MINI-1
  rect 0.8x0.4 smd: 1(-5.9,4) 2(-5.9,3.2) 3(-5.9,2.4) 4(-5.9,1.6) 5(-5.9,0.8) 6(-5.9,0) 7(-5.9,-0.8) 8(-5.9,-1.6) 9(-5.9,-2.4) 10(-5.9,-3.2) 11(-5.9,-4) 25(5.9,-4) 26(5.9,-3.2) 27(5.9,-2.4) 28(5.9,-1.6) 29(5.9,-0.8) 30(5.9,0) 31(5.9,0.8) 32(5.9,1.6) 33(5.9,2.4) 34(5.9,3.2) 35(5.9,4)
  rect 0.4x0.8 smd: 12(-4.8,-4.9) 13(-4,-4.9) 14(-3.2,-4.9) 15(-2.4,-4.9) 16(-1.6,-4.9) 17(-0.8,-4.9) 18(0,-4.9) 19(0.8,-4.9) 20(1.6,-4.9) 21(2.4,-4.9) 22(3.2,-4.9) 23(4,-4.9) 24(4.8,-4.9) 36(4.8,4.9) 37(4,4.9) 38(3.2,4.9) 39(2.4,4.9) 40(1.6,4.9) 41(0.8,4.9) 42(0,4.9) 43(-0.8,4.9) 44(-1.6,4.9) 45(-2.4,4.9) 46(-3.2,4.9) 47(-4,4.9) 48(-4.8,4.9)
  custom 1.45x1.45 smd: 49(-1.975,1.975)
  rect 1.45x1.45 smd: 49(-1.975,0) 49(-1.975,-1.975) 49(0,1.975) 49(0,0) 49(0,-1.975) 49(1.975,1.975) 49(1.975,0) 49(1.975,-1.975)
  rect 0.7x0.7 smd: 50(5.95,4.95) 51(5.95,-4.95) 52(-5.95,-4.95) 53(-5.95,4.95)

## Nets
As in the schematic.

Pads without a net: CN1 3 4; CN2 3 4; CN3 3 4; CN4 3 4; CN5 3 4; CN6 3 4; U1 4; U2 6; U4 9; U5 1; U9 6; U12 5; U13 5; U14 5; U15 5; U16 1 2 4 7 9 10 11 14 15 17 24 25 28 29 32 33 34 35 36 37 38 39 40 41 42 43 44 45 46 47 48 49 50 51 52 53; U17 7 8
